# Altium project CM4.PrjPcb
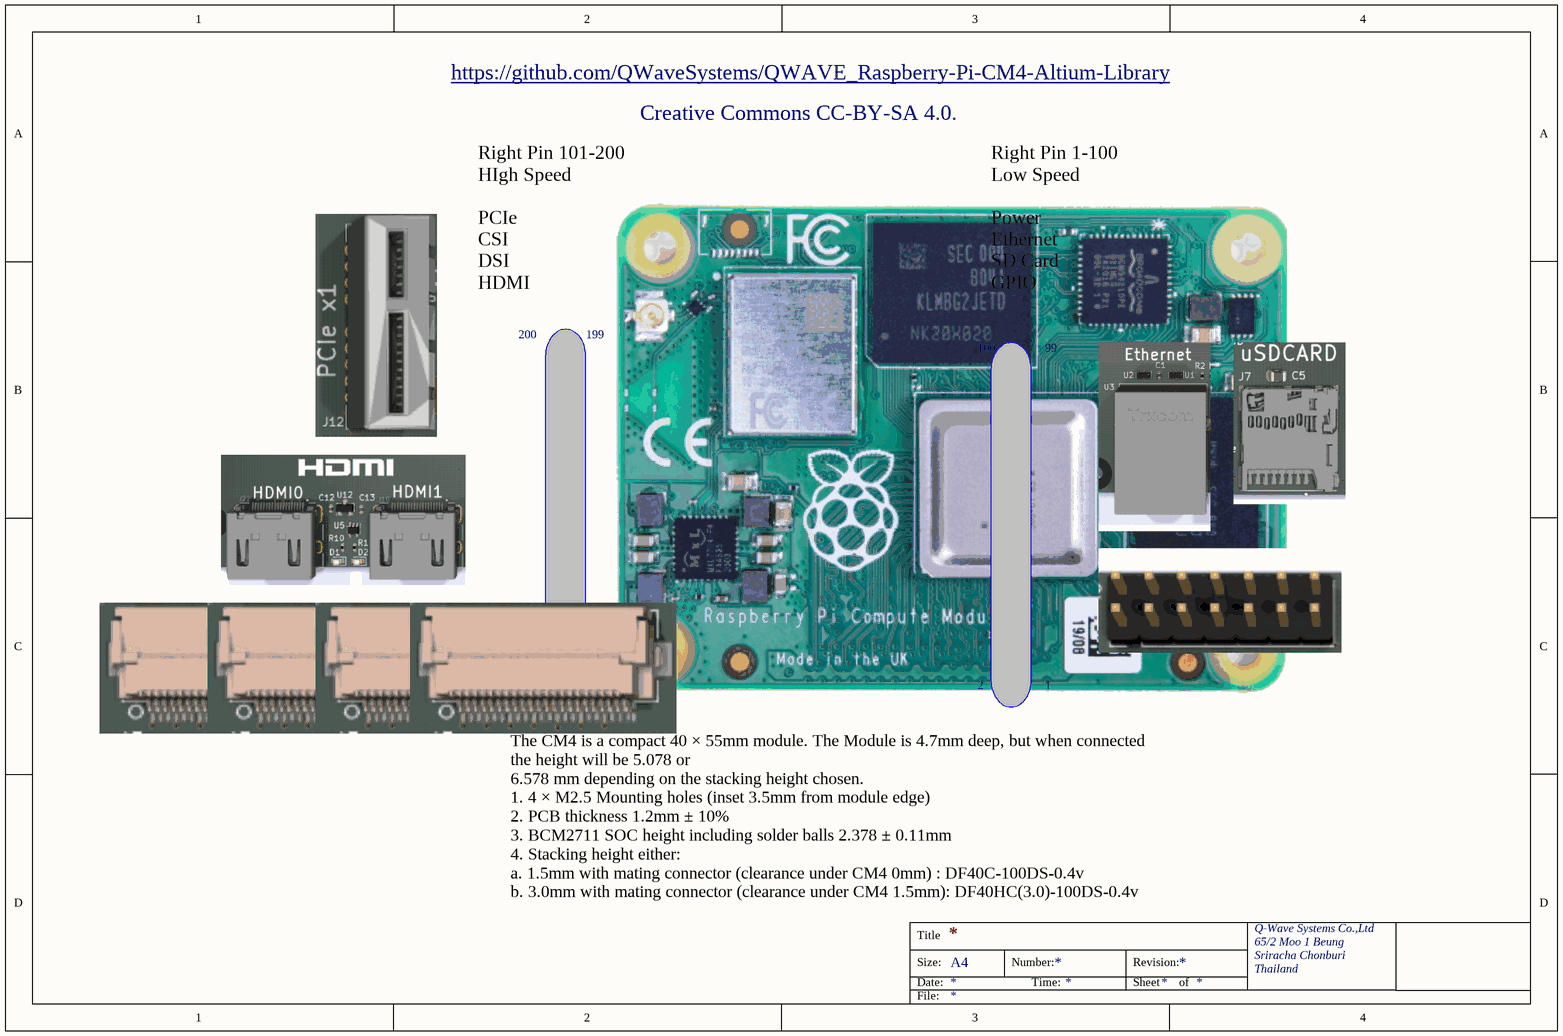
[diagram p0: Top_Level_Block Diagram.SchDoc]
22 sheets, 11 parts. Net scope: global (net labels, ports and power ports of the same name join across sheets).
Board file: CM4-Main.PcbDoc
Sheets:
  Top_Level_Block Diagram.SchDoc
  All Component_0.SchDoc
  All Component_1.SchDoc
  Connector.SchDoc
  Spacer_M2.5.SchDoc
  GPIO.SchDoc
  Power.SchDoc
  HDMI2.0.SchDoc
  CSI.SchDoc
  DSI.SchDoc
  Ethernet.SchDoc
  USB.SchDoc
  PCIe.SchDoc
  SD Card.SchDoc
  BT WiFi Power Reset Control.SchDoc
  TV DAC.SchDoc
  LEDs.SchDoc
  Differential Pair match spec.SchDoc
  CMIO4 PCB Stackup.SchDoc
  3D_Board_View.SchDoc
  QWAVE-Stackup_Design_6Layer_3GHz.SchDoc
  PCB_Footprint.SchDoc

## Sheet Top_Level_Block Diagram.SchDoc
size A4

### Notes on the sheet
- https://github.com/QWaveSystems/QWAVE_Raspberry-Pi-CM4-Altium-Library
- Creative Commons CC-BY-SA 4.0.
- Right Pin 101-200
  HIgh Speed
  PCIe
  CSI
  DSI
  HDMI
- Right Pin 1-100
  Low Speed
  Power
  Ethernet
  SD Card
  GPIO
- 200
- 199
- 100
- 99
- 102
- 101
- 2
- 1
- The CM4 is a compact 40 × 55mm module. The Module is 4.7mm deep, but when connected the height will be 5.078 or
  6.578 mm depending on the stacking height chosen.
  1. 4 × M2.5 Mounting holes (inset 3.5mm from module edge)
  2. PCB thickness 1.2mm ± 10%
  3. BCM2711 SOC height including solder balls 2.378 ± 0.11mm
  4. Stacking height either:
  a. 1.5mm with mating connector (clearance under CM4 0mm) : DF40C-100DS-0.4v
  b. 3.0mm with mating connector (clearance under CM4 1.5mm): DF40HC(3.0)-100DS-0.4v
- Title
- Size:
- Date:
- A4
- Number:
- Time:
- Revision:
- Sheet
- of
- Q-Wave Systems Co.,Ltd
- 65/2 Moo 1 Beung
- Sriracha Chonburi
- Thailand
- File:

## Sheet All Component_0.SchDoc
size A4
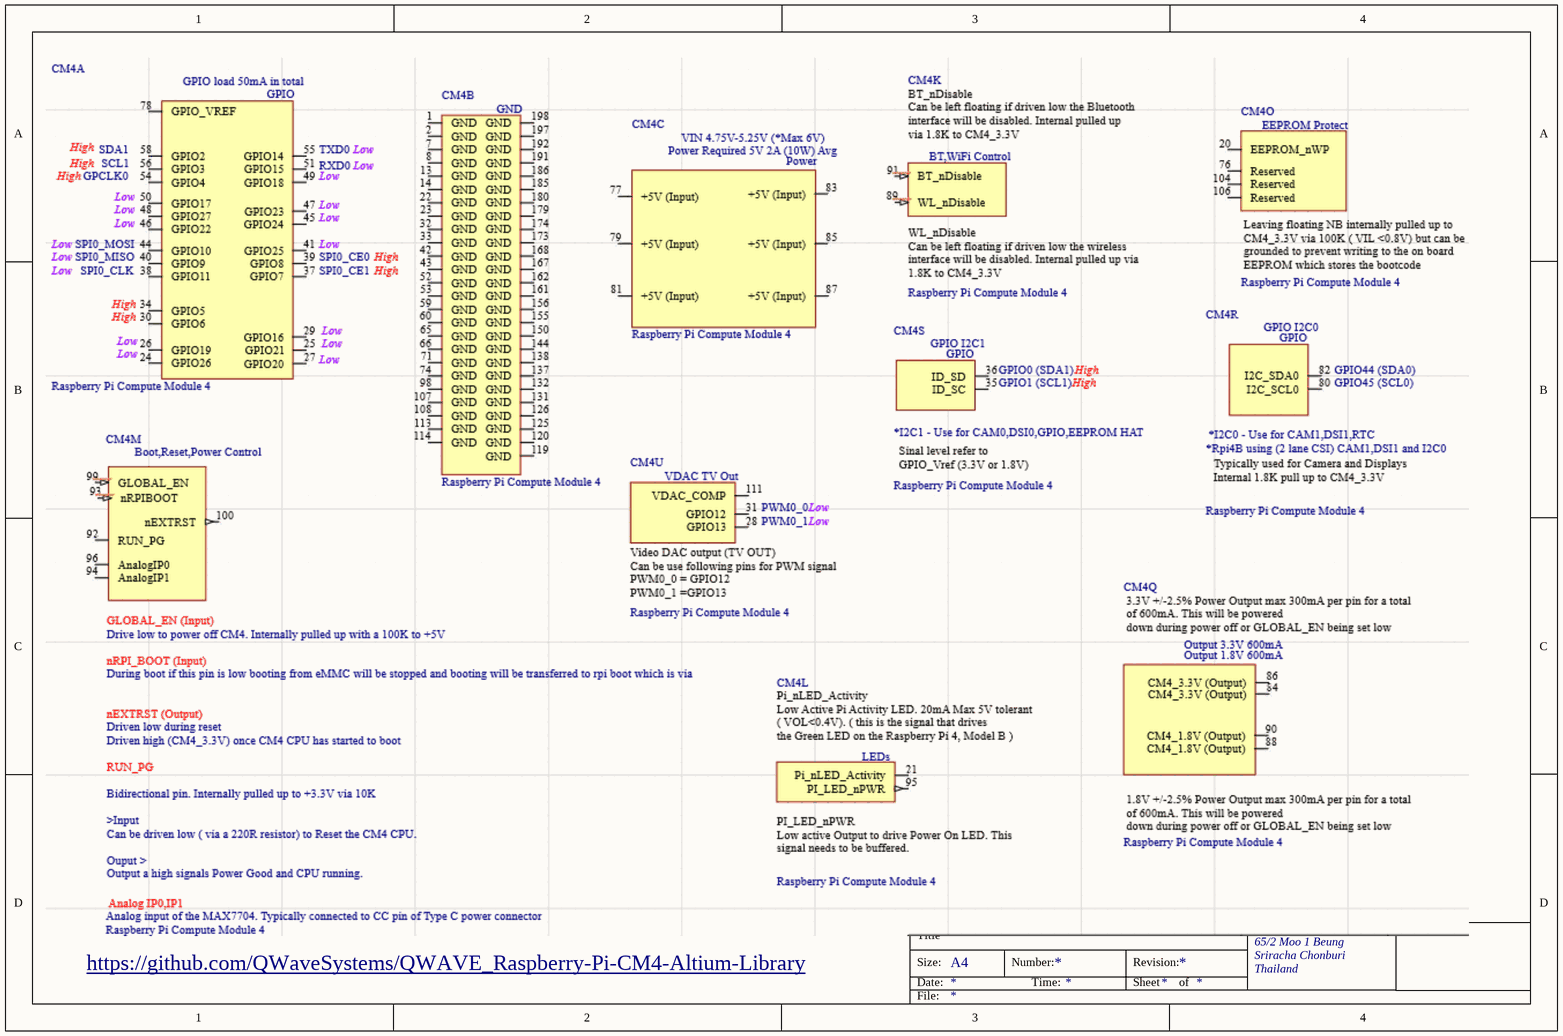
[diagram p1: All Component_0.SchDoc]

### Notes on the sheet
- https://github.com/QWaveSystems/QWAVE_Raspberry-Pi-CM4-Altium-Library
- Title
- Size:
- Date:
- A4
- Number:
- Time:
- Revision:
- Sheet
- of
- Q-Wave Systems Co.,Ltd
- 65/2 Moo 1 Beung
- Sriracha Chonburi
- Thailand
- File:

## Sheet All Component_1.SchDoc
size A4
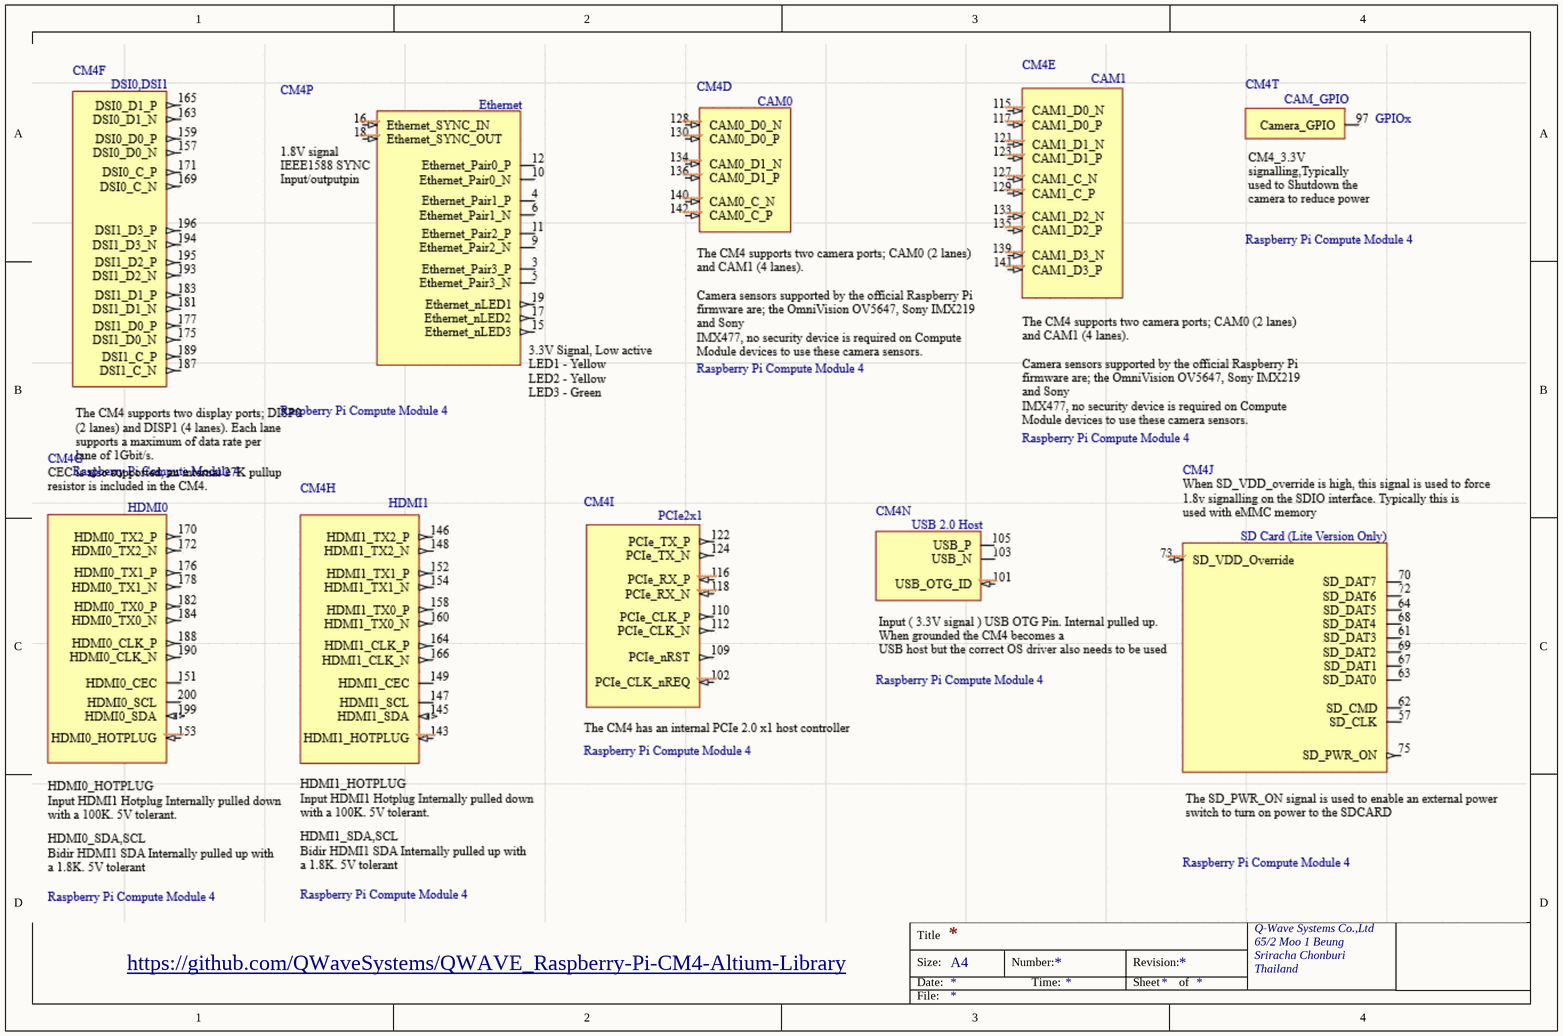
[diagram p2: All Component_1.SchDoc]

### Notes on the sheet
- https://github.com/QWaveSystems/QWAVE_Raspberry-Pi-CM4-Altium-Library
- Title
- Size:
- Date:
- A4
- Number:
- Time:
- Revision:
- Sheet
- of
- Q-Wave Systems Co.,Ltd
- 65/2 Moo 1 Beung
- Sriracha Chonburi
- Thailand
- File:

## Sheet Connector.SchDoc
size A4
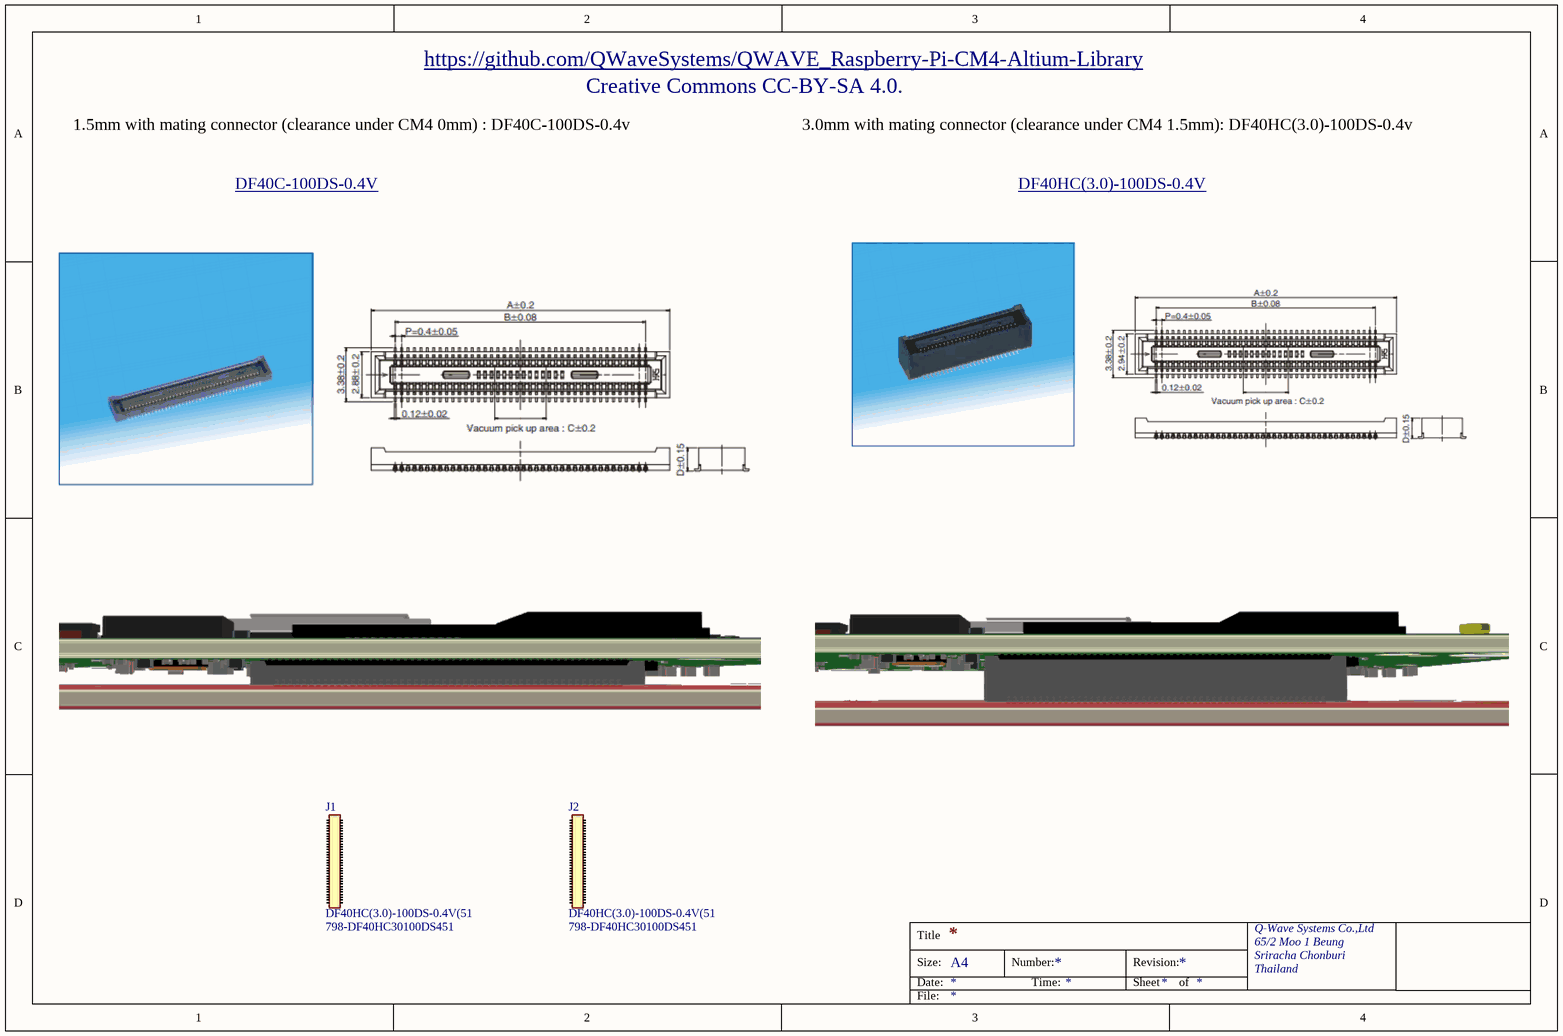
[diagram p3: Connector.SchDoc]

### Parts
J1  DF40HC(3.0)-100DS-0.4V(51  Supplier Part Number 1: 798-DF40HC30100DS451  [CM4-DF40]  (mechanical)
J2  DF40HC(3.0)-100DS-0.4V(51  Supplier Part Number 1: 798-DF40HC30100DS451  [CM4-DF40]  (mechanical)

### Notes on the sheet
- https://github.com/QWaveSystems/QWAVE_Raspberry-Pi-CM4-Altium-Library
- Creative Commons CC-BY-SA 4.0.
- 1.5mm with mating connector (clearance under CM4 0mm) : DF40C-100DS-0.4v
- 3.0mm with mating connector (clearance under CM4 1.5mm): DF40HC(3.0)-100DS-0.4v
- DF40C-100DS-0.4V <https://www.hirose.com/product/p/CL0684-4033-4-51>
- DF40HC(3.0)-100DS-0.4V <https://www.hirose.com/product/p/CL0684-4151-0-51>
- Title
- Size:
- Date:
- A4
- Number:
- Time:
- Revision:
- Sheet
- of
- Q-Wave Systems Co.,Ltd
- 65/2 Moo 1 Beung
- Sriracha Chonburi
- Thailand
- File:

### Library data of the parts
J1 J2 = DF40HC_3.0_-100DS-0.4V_51: Conn Board to Board RCP 100 POS 0.4mm Solder ST SMD T/R; Manufacturer_Name: Hirose; Connector Type: Receptacle; Number of Positions: 100; Pitch: 0.016inch; Datasheet Link: https://componentsearchengine.com/Datasheets/1/DF40HC(3.0)-100DS-0.4V(51.pdf; Height: 3.05mm; Manufacturer_Part_Number: DF40HC(3.0)-100DS-0.4V(51; Mouser Part Number: 798-DF40HC30100DS451; Mouser Price/Stock: https://www.mouser.co.uk/ProductDetail/Hirose-Connector/DF40HC30-100DS-04V51/?qs=%252BAZVS4b%2FkgIV%252B3vHYy2dCA%3D%3D; Arrow Part Number: DF40HC(3.0)-100DS-0.4V(51; Arrow Price/Stock: https://www.arrow.com/en/products/df40hc-3.0-100ds-0.4v-51/hirose-electric; Supplier 1: Mouser; Manufacturer: Hirose; Manufacturer Part Number: DF40HC(3.0)-100DS-0.4V(51; RoHS: Yes; Category: Headers and Wire Housings; Stock 1: 1901; Pricing 1: 1=2.50000, 10=2.15000, 50=2.15000, 100=2.00000, 1000=1.45000, 10000=1.29000 (USD); Mount: Surface Mount; Contact Plating: Gold; Package Quantity: 3000; Packaging: Tape and Reel; Number of Rows: 2; ComponentLink1URL: https://datasheet.ciiva.com/13559/ed-df40-20140305-13559540.pdf?src-supplier=Mouser; ComponentLink1Description: https://datasheet.ciiva.com/13559/ed-df40-20140305-13559540.pdf?src-supplier=Mouser; ComponentLink2URL: https://datasheet.ciiva.com/18562/ed-df40-20140305-18562462.pdf?src-supplier=Digi-Key; ComponentLink2Description: https://datasheet.ciiva.com/18562/ed-df40-20140305-18562462.pdf?src-supplier=Digi-Key

## Sheet Spacer_M2.5.SchDoc
size A4
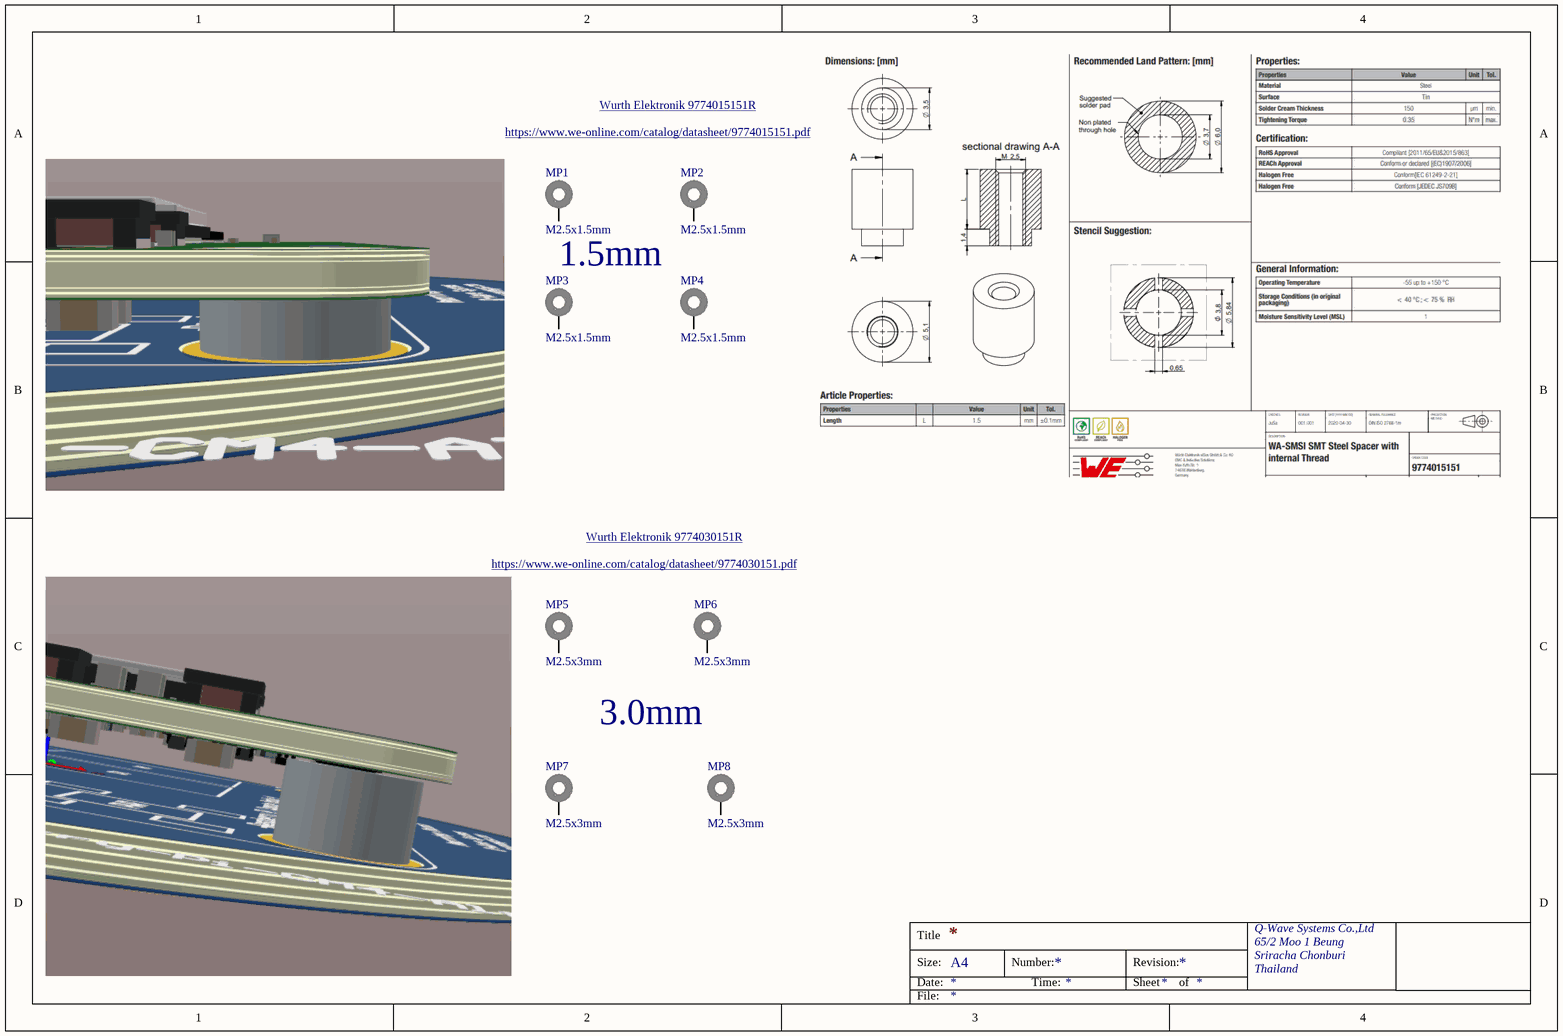
[diagram p4: Spacer_M2.5.SchDoc]

### Parts
MP1  M2.5x1.5mm  [9774015151]
MP2  M2.5x1.5mm  [9774015151]
MP3  M2.5x1.5mm  [9774015151]
MP4  M2.5x1.5mm  [9774015151]
MP5  M2.5x3mm  [9774030151]
MP6  M2.5x3mm  [9774030151]
MP7  M2.5x3mm  [9774030151]
MP8  M2.5x3mm  [9774030151]

### Nets

Not connected (* = marked no-connect by the designer): MP1 1; MP2 1; MP3 1; MP4 1; MP5 1; MP6 1; MP7 1; MP8 1

### Notes on the sheet
- Wurth Elektronik 9774015151R <https://th.mouser.com/ProductDetail/Wurth-Elektronik/9774015151R?qs=KRpiEsko4Hl%2FDg5uCSpysw%3D%3D>
- https://www.we-online.com/catalog/datasheet/9774015151.pdf
- 1.5mm
- https://www.we-online.com/catalog/datasheet/9774030151.pdf
- Wurth Elektronik 9774030151R <https://th.mouser.com/ProductDetail/Wurth-Elektronik/9774030151R?qs=%2Fha2pyFaduhpL3ruLypYIwk1EDfzek6QtU2BoXAdTMSAq8D2gXpyew%3D%3D>
- 3.0mm
- Title
- Size:
- Date:
- A4
- Number:
- Time:
- Revision:
- Sheet
- of
- Q-Wave Systems Co.,Ltd
- 65/2 Moo 1 Beung
- Sriracha Chonburi
- Thailand
- File:

### Library data of the parts
MP1-MP4 = 9774015151: WA-SMSI SMT Steel Spacer, M2.5 Thread Internal, OD 5.1mm, M2.5x1.5mm; Manufacturer: Wurth Elektronik; Inner Diameter: 3.5mm; Surface: Tin; ComponentLink1Description: Manufacturer; ComponentLink1URL: http://www.we-online.de; ComponentLink2Description: Datasheet; ComponentLink2URL: https://www.we-online.com/catalog/datasheet/9774015151.pdf; Mounting Technology: SMT; Packaging: Bulk; Manufacturer Part Number: 9774015151; Length: 1.5mm; Inner Thread Length: -; Operating Temperature: -55 to +150degC; Outer Diameter: 5.1mm; Published Date: April 2020; Material: Steel; Thread: M2.5
MP5-MP8 = 9774030151: WA-SMSI SMT Steel Spacer, M2.5 Thread Internal, OD 5.1mm, M2.5x3mm; Manufacturer: Wurth Elektronik; Inner Diameter: 3.5mm; Surface: Tin; ComponentLink1Description: Manufacturer; ComponentLink1URL: http://www.we-online.de; ComponentLink2Description: Datasheet; ComponentLink2URL: https://www.we-online.com/catalog/datasheet/9774030151.pdf; Mounting Technology: SMT; Packaging: Bulk; Manufacturer Part Number: 9774030151; Length: 3mm; Inner Thread Length: -; Operating Temperature: -55 to +150degC; Outer Diameter: 5.1mm; Published Date: April 2020; Material: Steel; Thread: M2.5

## Sheet GPIO.SchDoc
size A4
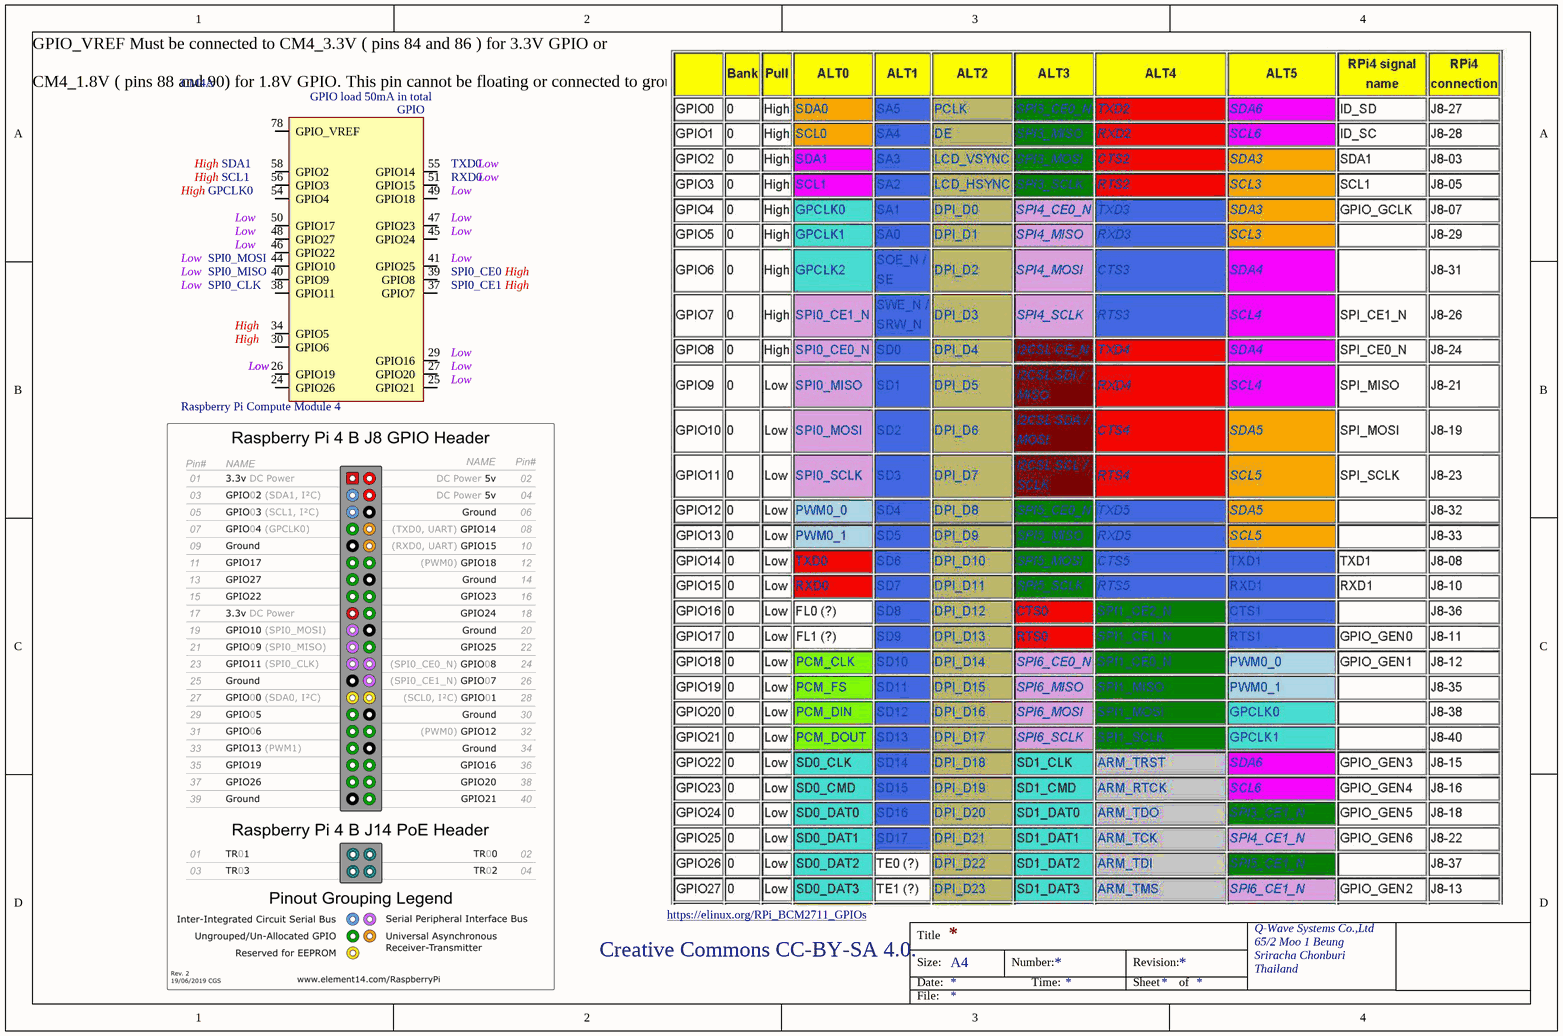
[diagram p5: GPIO.SchDoc]

### Parts
CM4  Raspberry Pi Compute Module 4  [CM4-F40C-100DS-0.4v_1.5mm_0mm]  (part A of 21)  (no BOM)

### Nets

Not connected (* = marked no-connect by the designer): CM4 24(GPIO26) 25(GPIO21) 26(GPIO19) 27(GPIO20) 29(GPIO16) 30(GPIO6) 34(GPIO5) 37(GPIO7) 38(GPIO11) 39(GPIO8) 40(GPIO9) 41(GPIO25) 44(GPIO10) 45(GPIO24) 46(GPIO22) 47(GPIO23) 48(GPIO27) 49(GPIO18) 50(GPIO17) 51(GPIO15) 54(GPIO4) 55(GPIO14) 56(GPIO3) 58(GPIO2) 78(GPIO_VREF)

### Notes on the sheet
- (near CM4) GPIO_VREF Must be connected to CM4_3.3V ( pins 84 and 86 ) for 3.3V GPIO or
  CM4_1.8V ( pins 88 and 90) for 1.8V GPIO. This pin cannot be floating or connected to ground
- https://elinux.org/RPi_BCM2711_GPIOs
- Creative Commons CC-BY-SA 4.0.
- Title
- Size:
- Date:
- A4
- Number:
- Time:
- Revision:
- Sheet
- of
- Q-Wave Systems Co.,Ltd
- 65/2 Moo 1 Beung
- Sriracha Chonburi
- Thailand
- File:
- (in symbol CM4, part A) GPIO load 50mA in total; GPIO; High; SDA1; TXD0; Low; SCL1; RXD0; GPCLK0; SPI0_MOSI; SPI0_MISO; SPI0_CE0; SPI0_CLK; SPI0_CE1; by Amornthep Phunsin

### Library data of the parts
CM4 = CM4: Raspberry Pi Compute Module 4 by Amornthep Phunsin

## Sheet Power.SchDoc
size A4
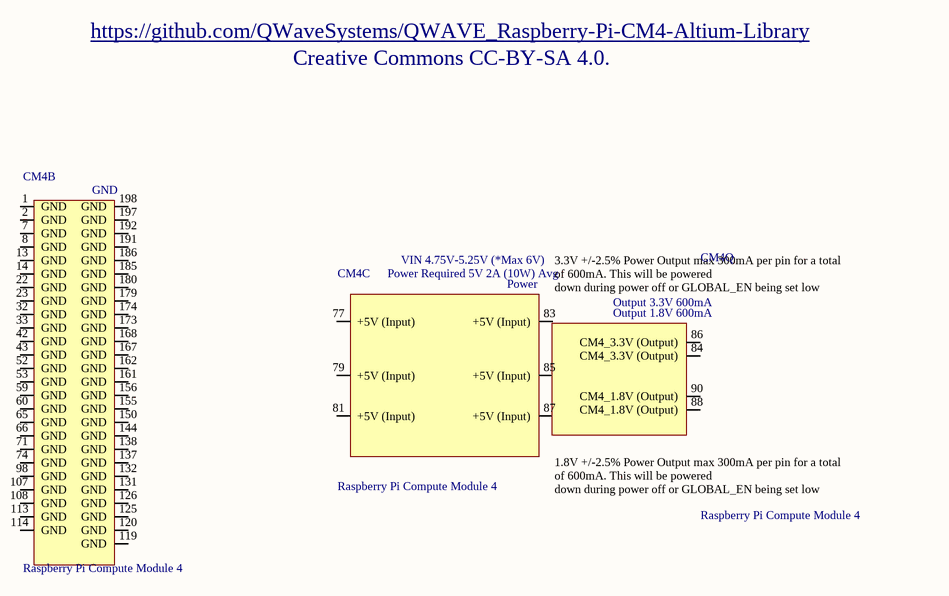
[diagram p6: Power.SchDoc]

### Parts
CM4  Raspberry Pi Compute Module 4  [CM4-F40C-100DS-0.4v_1.5mm_0mm]  (parts B,C,Q of 21)  (no BOM)

### Nets

Not connected (* = marked no-connect by the designer): CM4 1(GND) 2(GND) 7(GND) 8(GND) 13(GND) 14(GND) 22(GND) 23(GND) 32(GND) 33(GND) 42(GND) 43(GND) 52(GND) 53(GND) 59(GND) 60(GND) 65(GND) 66(GND) 71(GND) 74(GND) 77(+5V_(Input)) 79(+5V_(Input)) 81(+5V_(Input)) 83(+5V_(Input)) 84(CM4_3.3V_(Output)) 85(+5V_(Input)) 86(CM4_3.3V_(Output)) 87(+5V_(Input)) 88(CM4_1.8V_(Output)) 90(CM4_1.8V_(Output)) 98(GND) 107(GND) 108(GND) 113(GND) 114(GND) 119(GND) 120(GND) 125(GND) 126(GND) 131(GND) 132(GND) 137(GND) 138(GND) 144(GND) 150(GND) 155(GND) 156(GND) 161(GND) 162(GND) 167(GND) 168(GND) 173(GND) 174(GND) 179(GND) 180(GND) 185(GND) 186(GND) 191(GND) 192(GND) 197(GND) 198(GND)

### Notes on the sheet
- https://github.com/QWaveSystems/QWAVE_Raspberry-Pi-CM4-Altium-Library
- Creative Commons CC-BY-SA 4.0.
- Title
- Size:
- Date:
- A4
- Number:
- Time:
- Revision:
- Sheet
- of
- Q-Wave Systems Co.,Ltd
- 65/2 Moo 1 Beung
- Sriracha Chonburi
- Thailand
- File:
- (in symbol CM4, part C) VIN 4.75V-5.25V (*Max 6V); Power Required 5V 2A (10W) Avg; Power; by Amornthep Phunsin
- (in symbol CM4, part Q) 3.3V +/-2.5% Power Output max 300mA per pin for a total of 600mA. This will be powered / down during power off or GLOBAL_EN being set low; Output 3.3V 600mA; Output 1.8V 600mA; 1.8V +/-2.5% Power Output max 300mA per pin for a total of 600mA. This will be powered / down during power off or GLOBAL_EN being set low

### Library data of the parts
CM4 = CM4: as CM4 on sheet GPIO

## Sheet HDMI2.0.SchDoc
size A4
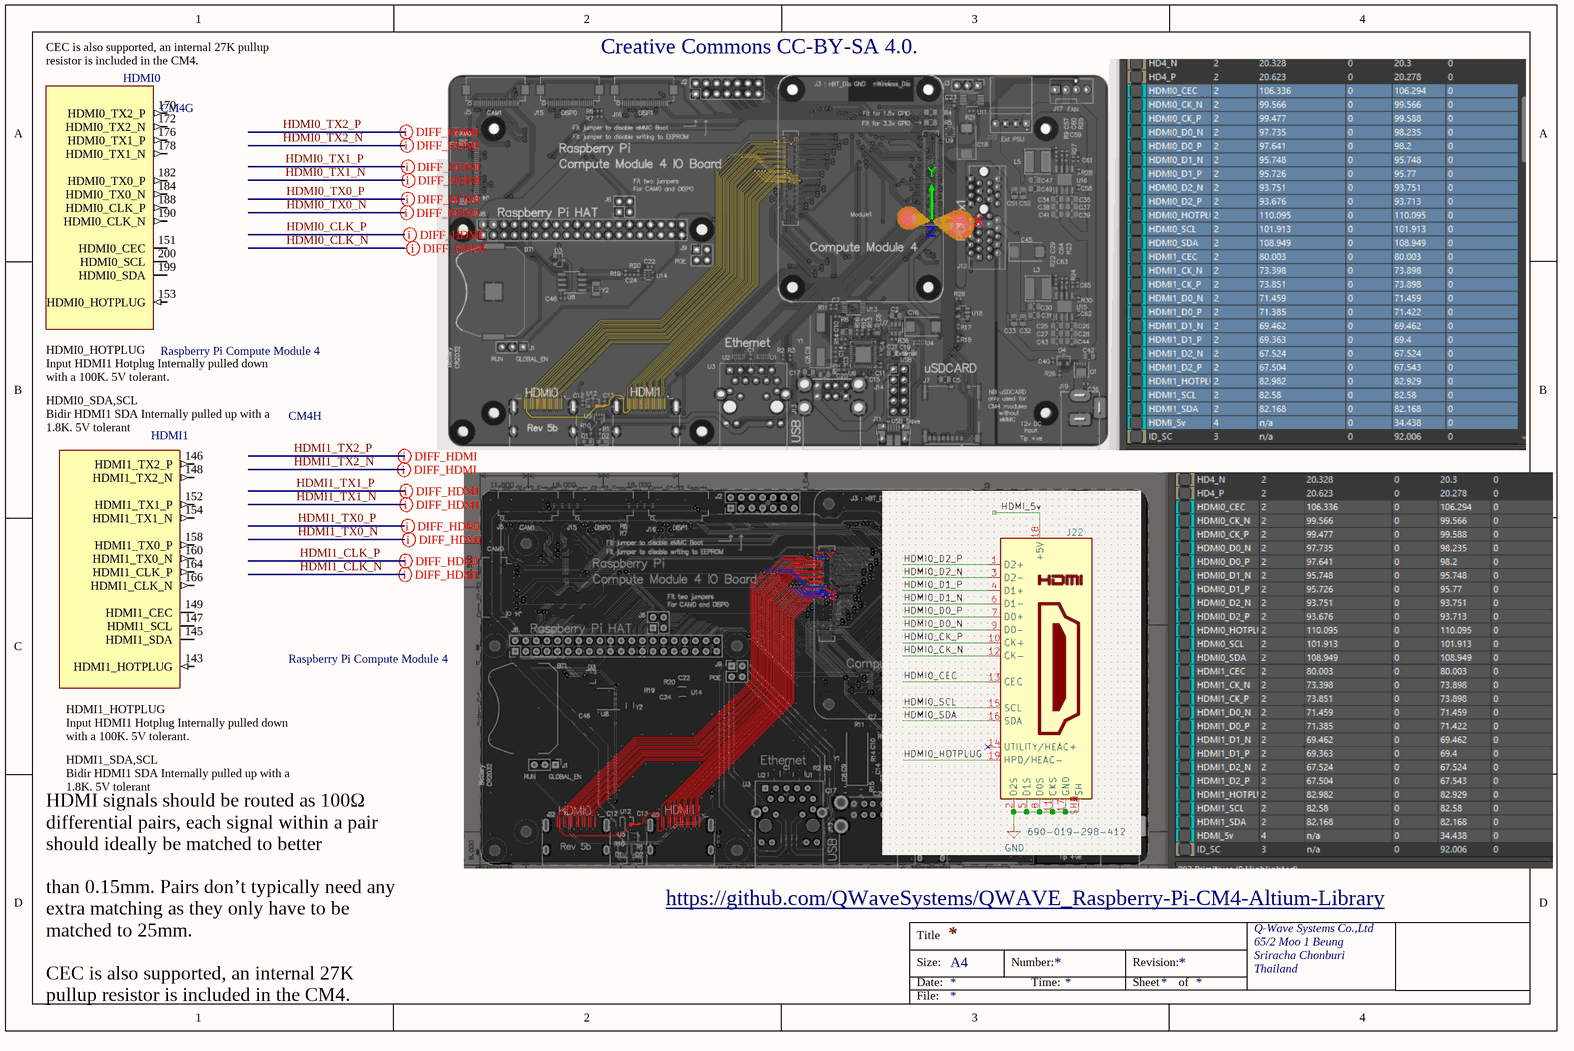
[diagram p7: HDMI2.0.SchDoc]

### Parts
CM4  Raspberry Pi Compute Module 4  [CM4-F40C-100DS-0.4v_1.5mm_0mm]  (parts G,H of 21)  (no BOM)

### Nets

Not connected (* = marked no-connect by the designer): CM4 143(HDMI1_HOTPLUG) 145(HDMI1_SDA) 146(HDMI1_TX2_P) 147(HDMI1_SCL) 148(HDMI1_TX2_N) 149(HDMI1_CEC) 151(HDMI0_CEC) 152(HDMI1_TX1_P) 153(HDMI0_HOTPLUG) 154(HDMI1_TX1_N) 158(HDMI1_TX0_P) 160(HDMI1_TX0_N) 164(HDMI1_CLK_P) 166(HDMI1_CLK_N) 170(HDMI0_TX2_P) 172(HDMI0_TX2_N) 176(HDMI0_TX1_P) 178(HDMI0_TX1_N) 182(HDMI0_TX0_P) 184(HDMI0_TX0_N) 188(HDMI0_CLK_P) 190(HDMI0_CLK_N) 199(HDMI0_SDA) 200(HDMI0_SCL)

### Layout directives
differential pair; differential pair class DIFF_100Ohm_HDMI; differential pair class DIFF_HDMI; net class HDMI_18Gbps: HDMI0_CLK_N, HDMI0_CLK_P, HDMI0_TX0_N, HDMI0_TX0_P, HDMI0_TX1_N, HDMI0_TX1_P, HDMI0_TX2_N, HDMI0_TX2_P, HDMI1_CLK_N, HDMI1_CLK_P, HDMI1_TX0_N, HDMI1_TX0_P, HDMI1_TX1_N, HDMI1_TX1_P, HDMI1_TX2_N, HDMI1_TX2_P

### Notes on the sheet
- Creative Commons CC-BY-SA 4.0.
- https://github.com/QWaveSystems/QWAVE_Raspberry-Pi-CM4-Altium-Library
- HDMI signals should be routed as 100Ω differential pairs, each signal within a pair should ideally be matched to better
  than 0.15mm. Pairs don’t typically need any extra matching as they only have to be matched to 25mm.
  CEC is also supported, an internal 27K pullup resistor is included in the CM4.
- Title
- Size:
- Date:
- A4
- Number:
- Time:
- Revision:
- Sheet
- of
- Q-Wave Systems Co.,Ltd
- 65/2 Moo 1 Beung
- Sriracha Chonburi
- Thailand
- File:
- (in symbol CM4, part G) HDMI0; CEC is also supported, an internal 27K pullup resistor is included in the CM4.; HDMI0_HOTPLUG / Input HDMI1 Hotplug Internally pulled down with a 100K. 5V tolerant.; HDMI0_SDA,SCL / Bidir HDMI1 SDA Internally pulled up with a 1.8K. 5V tolerant
- (in symbol CM4, part H) HDMI1; HDMI1_HOTPLUG / Input HDMI1 Hotplug Internally pulled down with a 100K. 5V tolerant.; HDMI1_SDA,SCL / Bidir HDMI1 SDA Internally pulled up with a 1.8K. 5V tolerant

### Library data of the parts
CM4 = CM4: as CM4 on sheet GPIO

## Sheet CSI.SchDoc
size A4
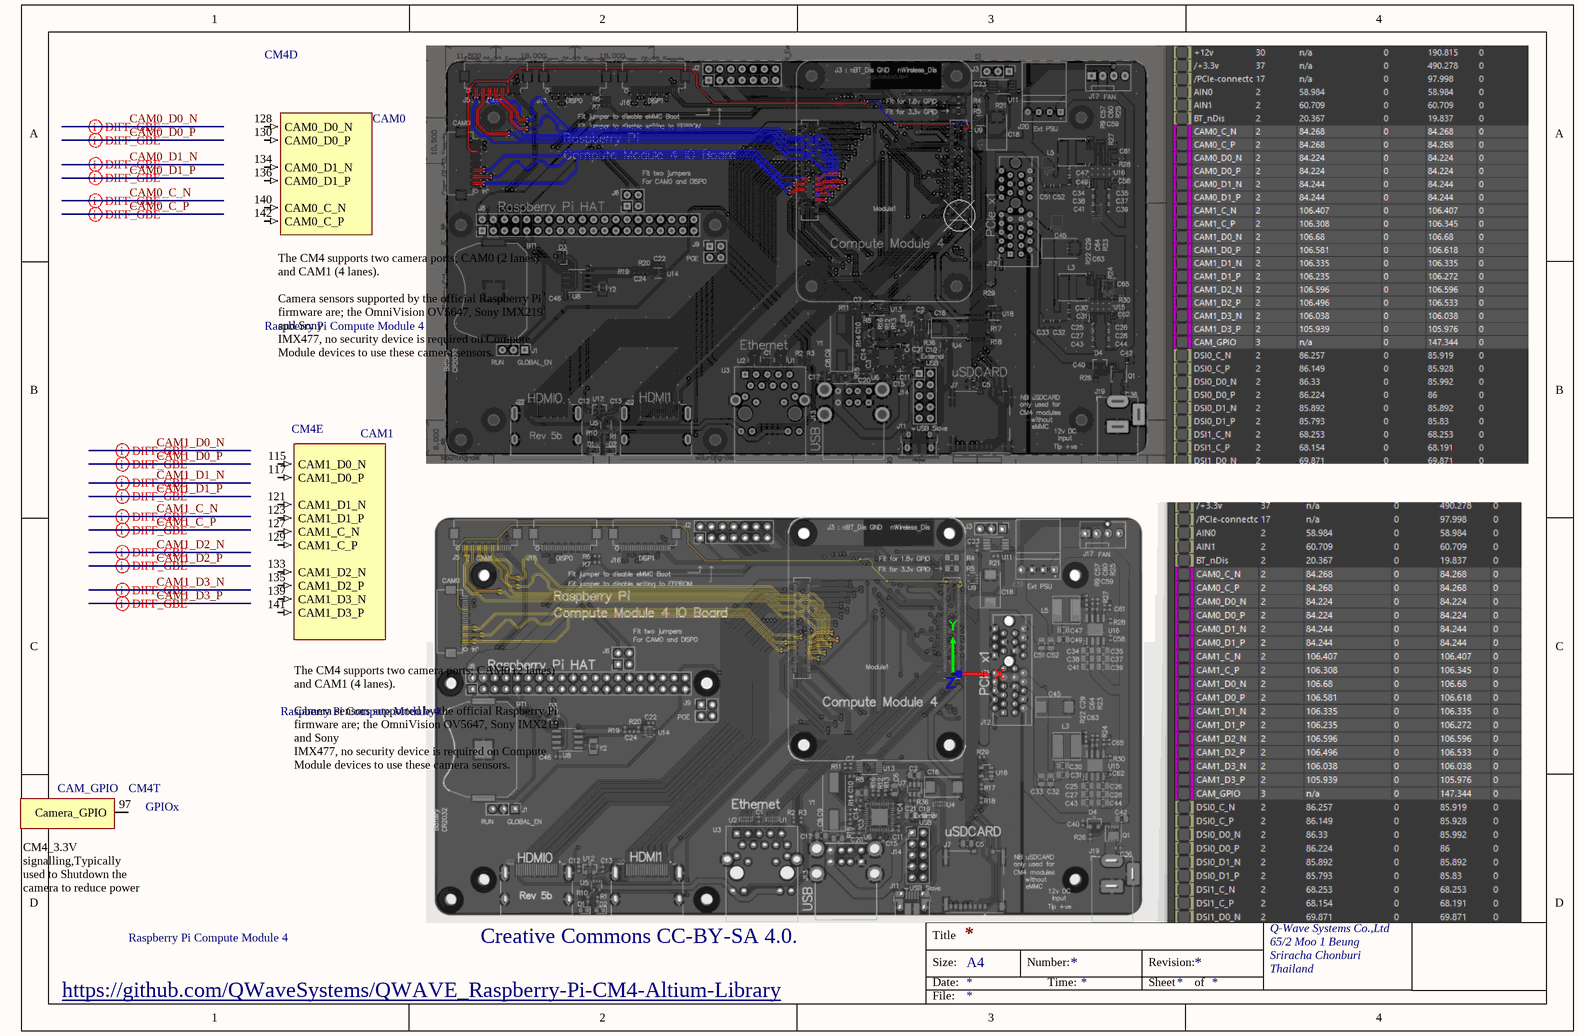
[diagram p8: CSI.SchDoc]

### Parts
CM4  Raspberry Pi Compute Module 4  [CM4-F40C-100DS-0.4v_1.5mm_0mm]  (parts D,E,T of 21)  (no BOM)

### Nets

Not connected (* = marked no-connect by the designer): CM4 97(Camera_GPIO) 115(CAM1_D0_N) 117(CAM1_D0_P) 121(CAM1_D1_N) 123(CAM1_D1_P) 127(CAM1_C_N) 128(CAM0_D0_N) 129(CAM1_C_P) 130(CAM0_D0_P) 133(CAM1_D2_N) 134(CAM0_D1_N) 135(CAM1_D2_P) 136(CAM0_D1_P) 139(CAM1_D3_N) 140(CAM0_C_N) 141(CAM1_D3_P) 142(CAM0_C_P)

### Layout directives
differential pair; differential pair class DIFF_100Ohm_MIPI; differential pair class DIFF_MIPI; net class MIPI_1Gbps: CAM0_C_N, CAM0_C_P, CAM0_D0_N, CAM0_D0_P, CAM0_D1_N, CAM0_D1_P, CAM1_C_N, CAM1_C_P, CAM1_D0_N, CAM1_D0_P, CAM1_D1_N, CAM1_D1_P, CAM1_D2_N, CAM1_D2_P, CAM1_D3_N, CAM1_D3_P

### Notes on the sheet
- Creative Commons CC-BY-SA 4.0.
- https://github.com/QWaveSystems/QWAVE_Raspberry-Pi-CM4-Altium-Library
- Title
- Size:
- Date:
- A4
- Number:
- Time:
- Revision:
- Sheet
- of
- Q-Wave Systems Co.,Ltd
- 65/2 Moo 1 Beung
- Sriracha Chonburi
- Thailand
- File:
- (in symbol CM4, part D) CAM0; The CM4 supports two camera ports; CAM0 (2 lanes) and CAM1 (4 lanes). / Camera sensors supported by the official Raspberry Pi firmware are; the OmniVision OV5647, Sony IMX219 and Sony / IMX477, no security device is required on Compute Module devices to use these camera sensors.
- (in symbol CM4, part E) CAM1; The CM4 supports two camera ports; CAM0 (2 lanes) and CAM1 (4 lanes). / Camera sensors supported by the official Raspberry Pi firmware are; the OmniVision OV5647, Sony IMX219 and Sony / IMX477, no security device is required on Compute Module devices to use these camera sensors.
- (in symbol CM4, part T) CAM_GPIO; GPIOx; CM4_3.3V signalling,Typically used to Shutdown the camera to reduce power

### Library data of the parts
CM4 = CM4: as CM4 on sheet GPIO

## Sheet DSI.SchDoc
size A4
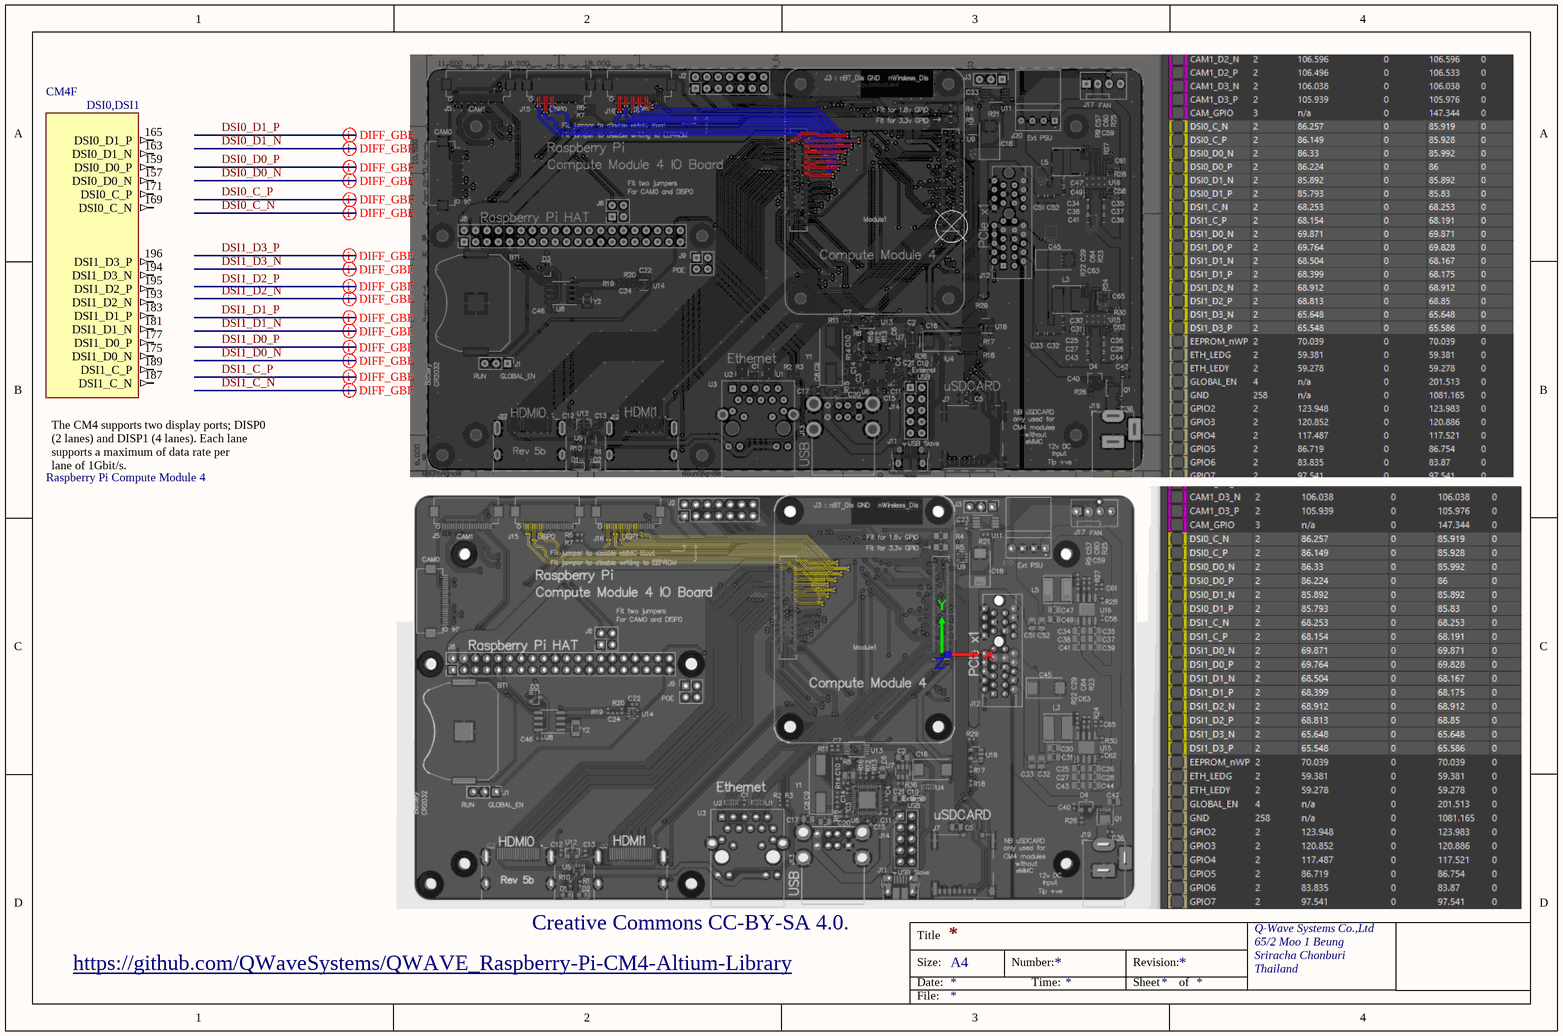
[diagram p9: DSI.SchDoc]

### Parts
CM4  Raspberry Pi Compute Module 4  [CM4-F40C-100DS-0.4v_1.5mm_0mm]  (part F of 21)  (no BOM)

### Nets

Not connected (* = marked no-connect by the designer): CM4 157(DSI0_D0_N) 159(DSI0_D0_P) 163(DSI0_D1_N) 165(DSI0_D1_P) 169(DSI0_C_N) 171(DSI0_C_P) 175(DSI1_D0_N) 177(DSI1_D0_P) 181(DSI1_D1_N) 183(DSI1_D1_P) 187(DSI1_C_N) 189(DSI1_C_P) 193(DSI1_D2_N) 194(DSI1_D3_N) 195(DSI1_D2_P) 196(DSI1_D3_P)

### Layout directives
differential pair; differential pair class DIFF_100Ohm_MIPI; differential pair class DIFF_MIPI; net class MIPI_1Gbps: DSI0_C_N, DSI0_C_P, DSI0_D0_N, DSI0_D0_P, DSI0_D1_N, DSI0_D1_P, DSI1_C_N, DSI1_C_P, DSI1_D0_N, DSI1_D0_P, DSI1_D1_N, DSI1_D1_P, DSI1_D2_N, DSI1_D2_P, DSI1_D3_N, DSI1_D3_P

### Notes on the sheet
- https://github.com/QWaveSystems/QWAVE_Raspberry-Pi-CM4-Altium-Library
- Creative Commons CC-BY-SA 4.0.
- Title
- Size:
- Date:
- A4
- Number:
- Time:
- Revision:
- Sheet
- of
- Q-Wave Systems Co.,Ltd
- 65/2 Moo 1 Beung
- Sriracha Chonburi
- Thailand
- File:
- (in symbol CM4, part F) DSI0,DSI1; The CM4 supports two display ports; DISP0 (2 lanes) and DISP1 (4 lanes). Each lane supports a maximum of data rate per / lane of 1Gbit/s.

### Library data of the parts
CM4 = CM4: as CM4 on sheet GPIO

## Sheet Ethernet.SchDoc
size A4
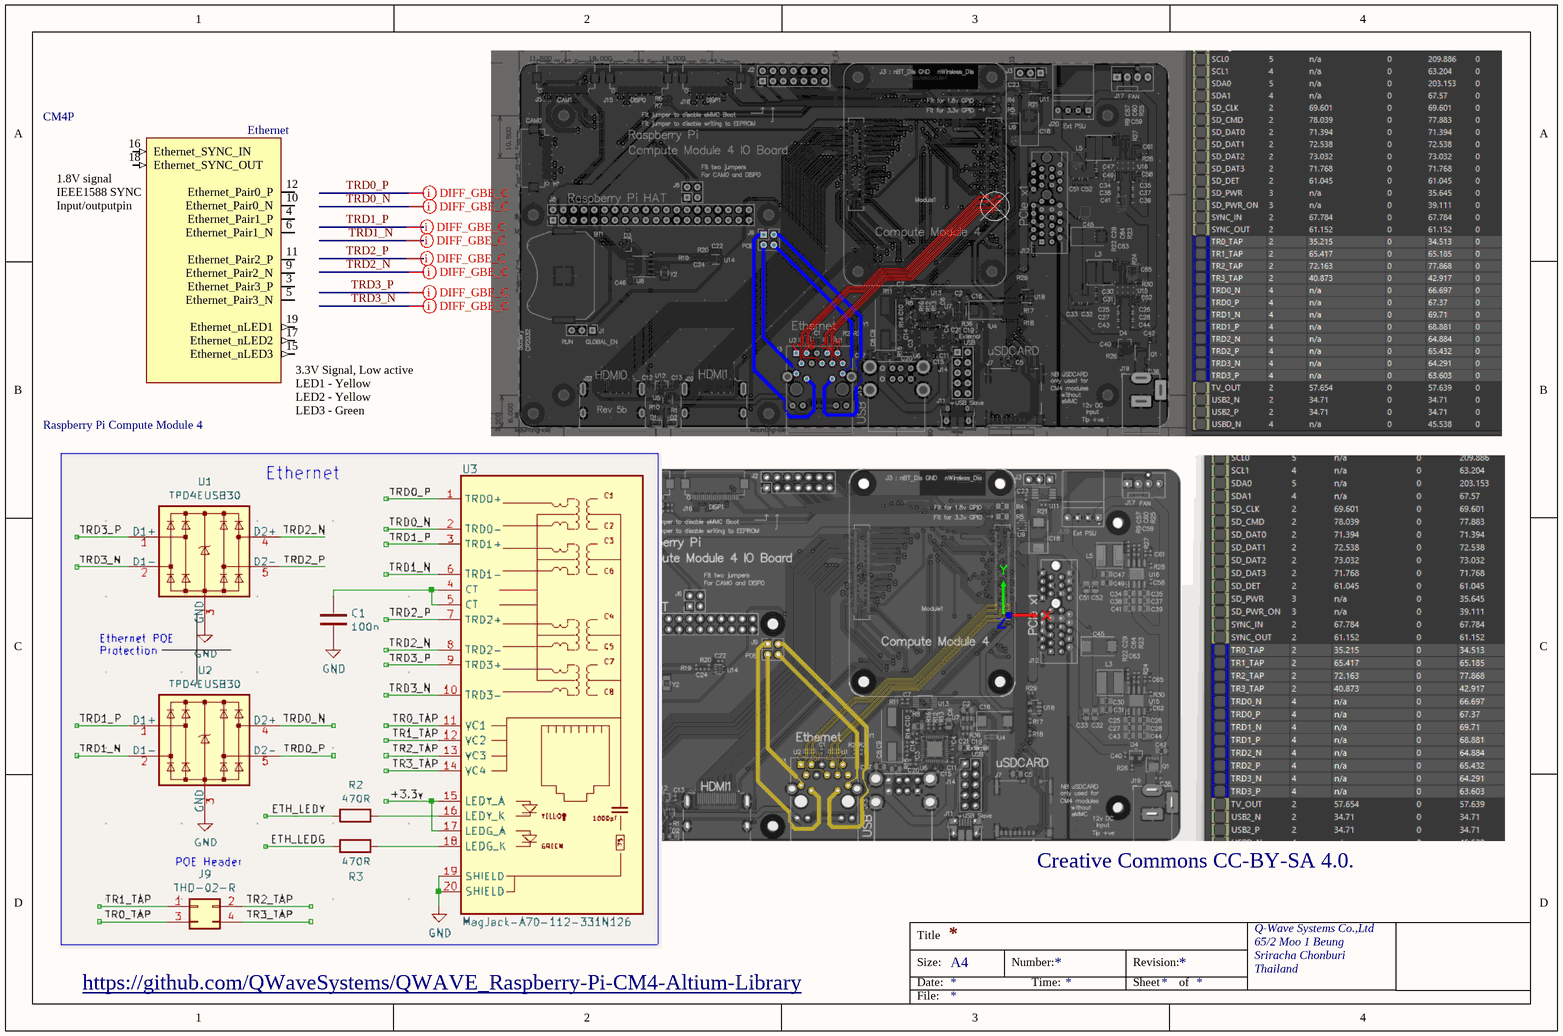
[diagram p10: Ethernet.SchDoc]

### Parts
CM4  Raspberry Pi Compute Module 4  [CM4-F40C-100DS-0.4v_1.5mm_0mm]  (part P of 21)  (no BOM)

### Nets

Not connected (* = marked no-connect by the designer): CM4 3(Ethernet_Pair3_P) 4(Ethernet_Pair1_P) 5(Ethernet_Pair3_N) 6(Ethernet_Pair1_N) 9(Ethernet_Pair2_N) 10(Ethernet_Pair0_N) 11(Ethernet_Pair2_P) 12(Ethernet_Pair0_P) 15(Ethernet_nLED3) 16(Ethernet_SYNC_IN) 17(Ethernet_nLED2) 18(Ethernet_SYNC_OUT) 19(Ethernet_nLED1)

### Layout directives
differential pair; differential pair class DIFF_100Ohm_GBE; differential pair class DIFF_LAN_GB; net class GBE_1Gbps: TRD0_N, TRD0_P, TRD1_N, TRD1_P, TRD2_N, TRD2_P, TRD3_N, TRD3_P

### Notes on the sheet
- Creative Commons CC-BY-SA 4.0.
- https://github.com/QWaveSystems/QWAVE_Raspberry-Pi-CM4-Altium-Library
- Title
- Size:
- Date:
- A4
- Number:
- Time:
- Revision:
- Sheet
- of
- Q-Wave Systems Co.,Ltd
- 65/2 Moo 1 Beung
- Sriracha Chonburi
- Thailand
- File:
- (in symbol CM4, part P) Ethernet; 1.8V signal / IEEE1588 SYNC Input/outputpin; by Amornthep Phunsin; 3.3V Signal, Low active / LED1 - Yellow / LED2 - Yellow / LED3 - Green

### Library data of the parts
CM4 = CM4: as CM4 on sheet GPIO

## Sheet USB.SchDoc
size A4
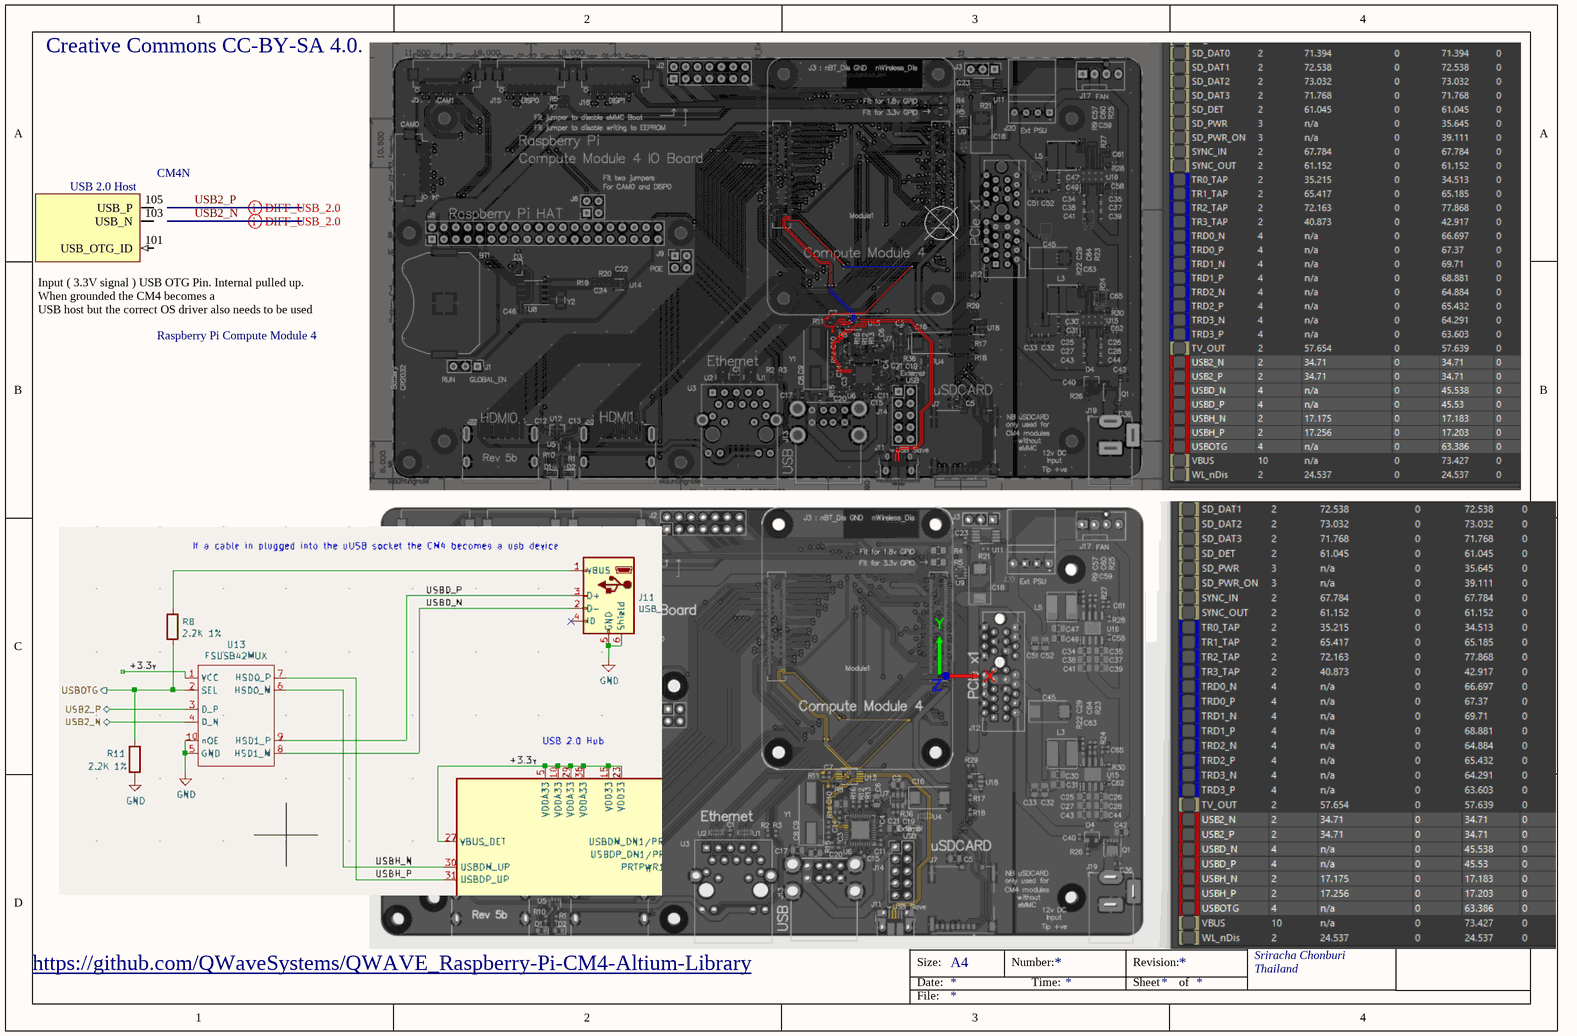
[diagram p11: USB.SchDoc]

### Parts
CM4  Raspberry Pi Compute Module 4  [CM4-F40C-100DS-0.4v_1.5mm_0mm]  (part N of 21)  (no BOM)

### Nets

Not connected (* = marked no-connect by the designer): CM4 101(USB_OTG_ID) 103(USB_N) 105(USB_P)

### Layout directives
differential pair; differential pair class DIFF_90Ohm_USB2.0; differential pair class DIFF_USB2.0; net class USB2.0_480Mbps: USB2_N, USB2_P

### Notes on the sheet
- Creative Commons CC-BY-SA 4.0.
- https://github.com/QWaveSystems/QWAVE_Raspberry-Pi-CM4-Altium-Library
- Title
- Size:
- Date:
- A4
- Number:
- Time:
- Revision:
- Sheet
- of
- Q-Wave Systems Co.,Ltd
- 65/2 Moo 1 Beung
- Sriracha Chonburi
- Thailand
- File:
- (in symbol CM4, part N) USB 2.0 Host; Input ( 3.3V signal ) USB OTG Pin. Internal pulled up. When grounded the CM4 becomes a / USB host but the correct OS driver also needs to be used

### Library data of the parts
CM4 = CM4: as CM4 on sheet GPIO

## Sheet PCIe.SchDoc
size A4
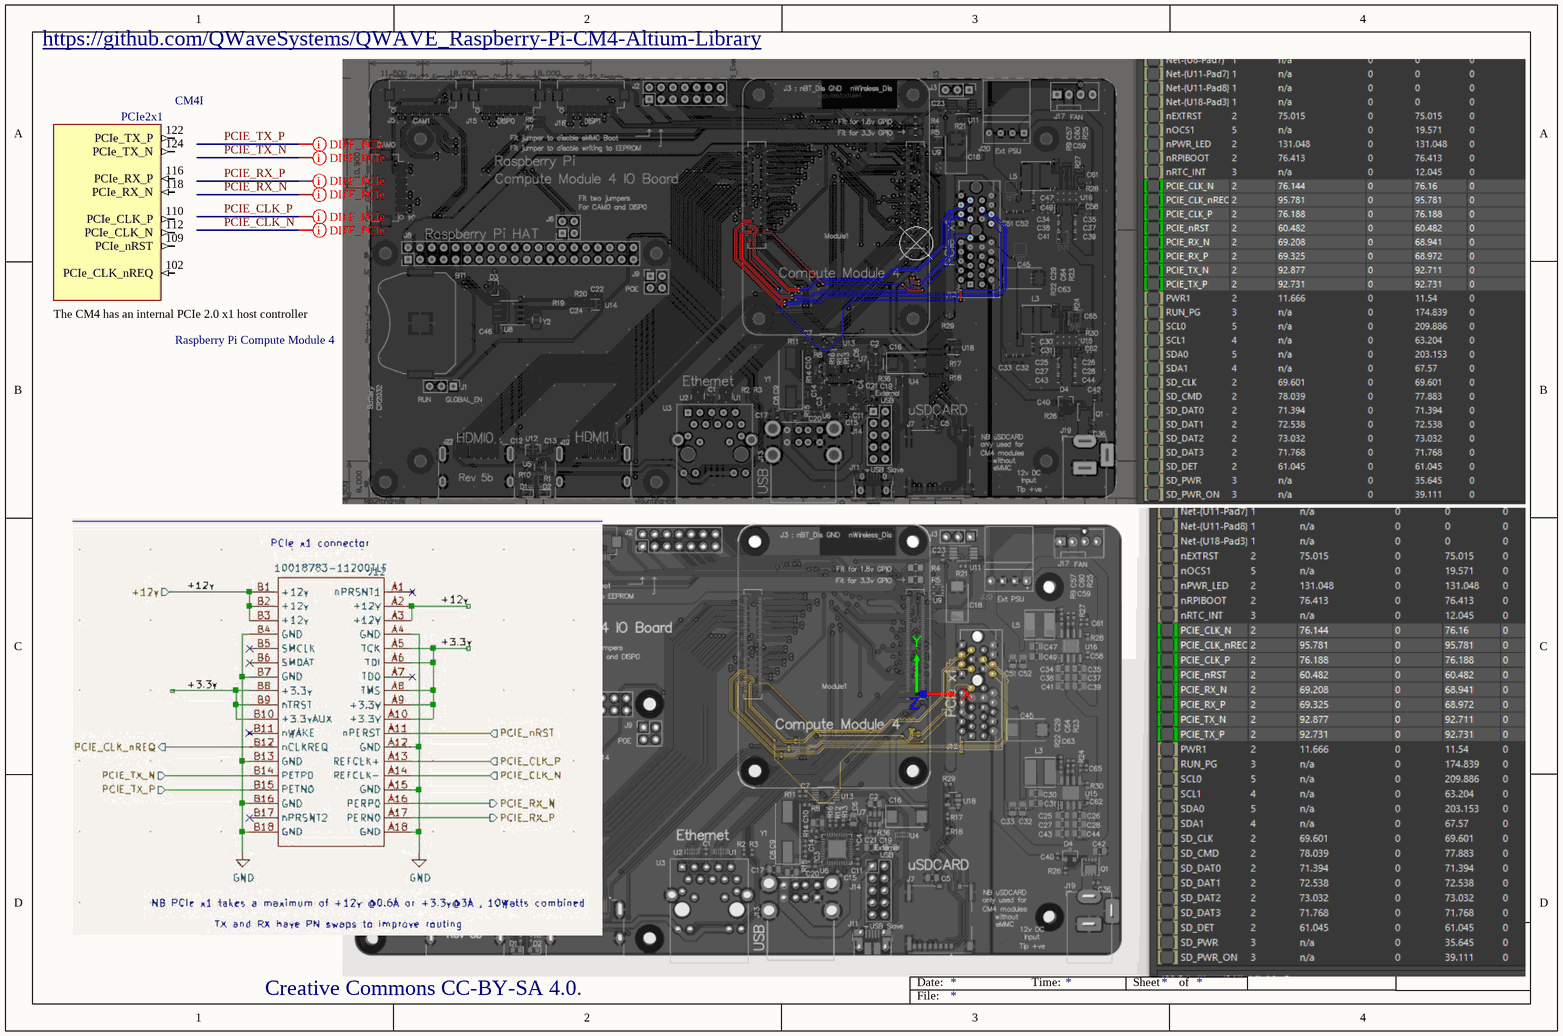
[diagram p12: PCIe.SchDoc]

### Parts
CM4  Raspberry Pi Compute Module 4  [CM4-F40C-100DS-0.4v_1.5mm_0mm]  (part I of 21)  (no BOM)

### Nets

Not connected (* = marked no-connect by the designer): CM4 102(PCIe_CLK_nREQ) 109(PCIe_nRST) 110(PCIe_CLK_P) 112(PCIe_CLK_N) 116(PCIe_RX_P) 118(PCIe_RX_N) 122(PCIe_TX_P) 124(PCIe_TX_N)

### Layout directives
differential pair; differential pair class DIFF_90Ohm_PCIe; differential pair class DIFF_PCIe; net class PCIe_5Gbps: PCIE_CLK_N, PCIE_CLK_P, PCIE_RX_N, PCIE_RX_P, PCIE_TX_N, PCIE_TX_P

### Notes on the sheet
- https://github.com/QWaveSystems/QWAVE_Raspberry-Pi-CM4-Altium-Library
- Creative Commons CC-BY-SA 4.0.
- Title
- Size:
- Date:
- A4
- Number:
- Time:
- Revision:
- Sheet
- of
- Q-Wave Systems Co.,Ltd
- 65/2 Moo 1 Beung
- Sriracha Chonburi
- Thailand
- File:
- (in symbol CM4, part I) PCIe2x1; The CM4 has an internal PCIe 2.0 x1 host controller

### Library data of the parts
CM4 = CM4: as CM4 on sheet GPIO

## Sheet SD Card.SchDoc
size A4
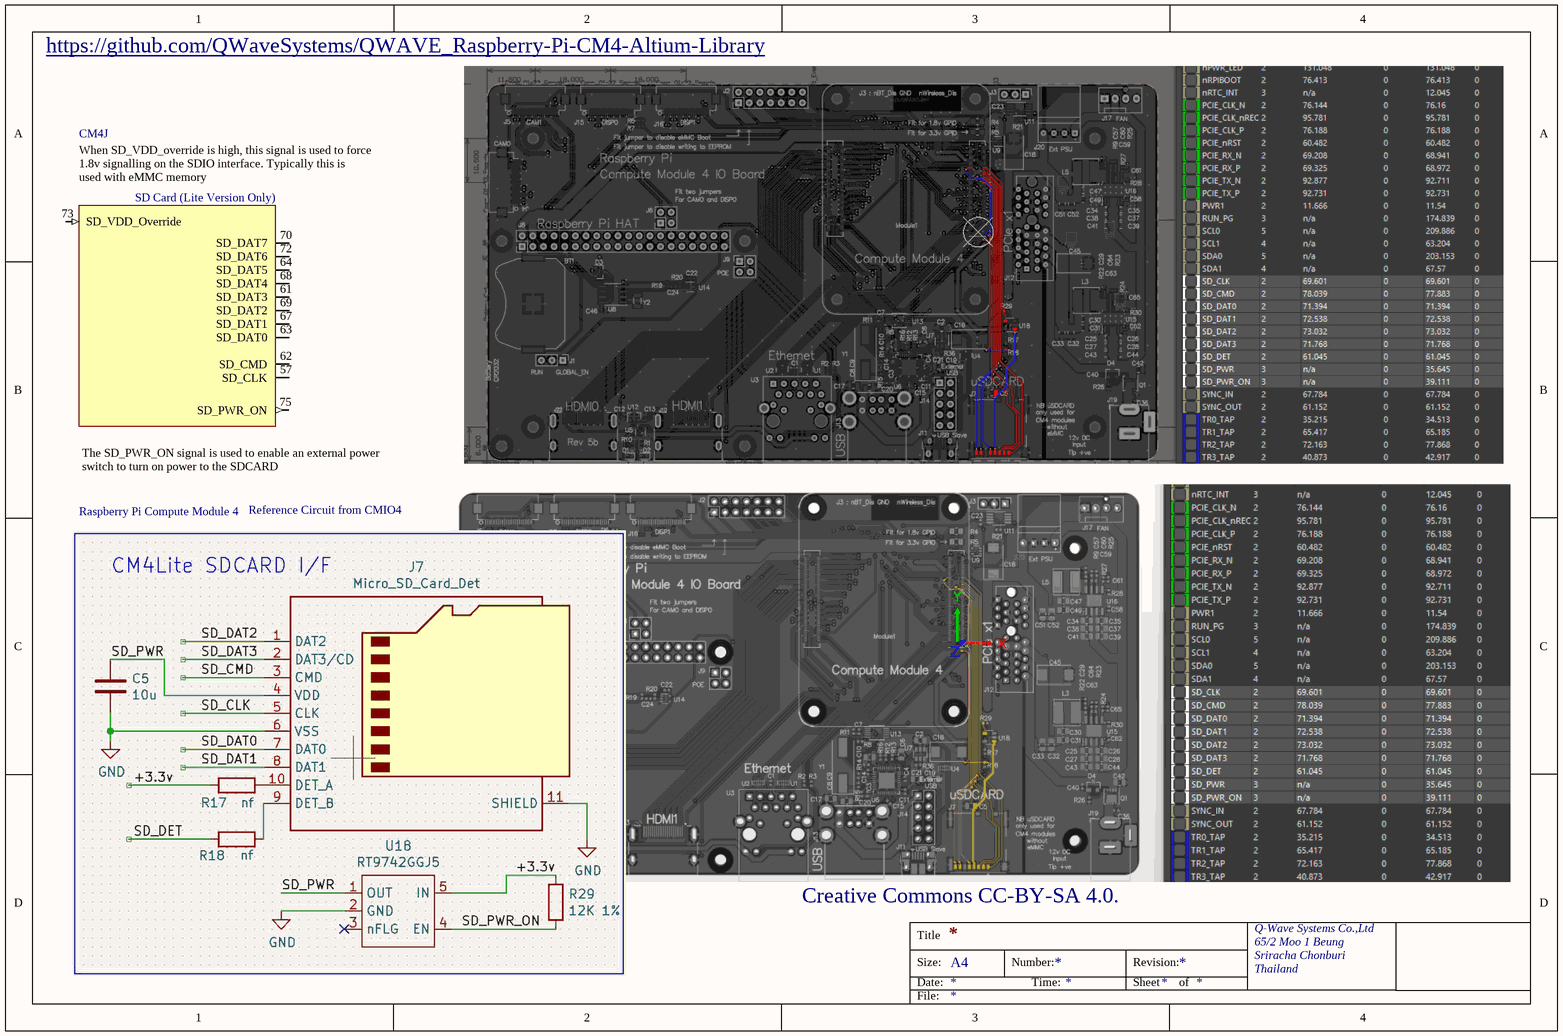
[diagram p13: SD Card.SchDoc]

### Parts
CM4  Raspberry Pi Compute Module 4  [CM4-F40C-100DS-0.4v_1.5mm_0mm]  (part J of 21)  (no BOM)

### Nets

Not connected (* = marked no-connect by the designer): CM4 57(SD_CLK) 61(SD_DAT3) 62(SD_CMD) 63(SD_DAT0) 64(SD_DAT5) 67(SD_DAT1) 68(SD_DAT4) 69(SD_DAT2) 70(SD_DAT7) 72(SD_DAT6) 73(SD_VDD_Override) 75(SD_PWR_ON)

### Notes on the sheet
- https://github.com/QWaveSystems/QWAVE_Raspberry-Pi-CM4-Altium-Library
- Reference Circuit from CMIO4
- Creative Commons CC-BY-SA 4.0.
- Title
- Size:
- Date:
- A4
- Number:
- Time:
- Revision:
- Sheet
- of
- Q-Wave Systems Co.,Ltd
- 65/2 Moo 1 Beung
- Sriracha Chonburi
- Thailand
- File:
- (in symbol CM4, part J) When SD_VDD_override is high, this signal is used to force 1.8v signalling on the SDIO interface. Typically this is / used with eMMC memory; SD Card (Lite Version Only); by Amornthep Phunsin; The SD_PWR_ON signal is used to enable an external power switch to turn on power to the SDCARD

### Library data of the parts
CM4 = CM4: as CM4 on sheet GPIO

## Sheet BT WiFi Power Reset Control.SchDoc
size A4
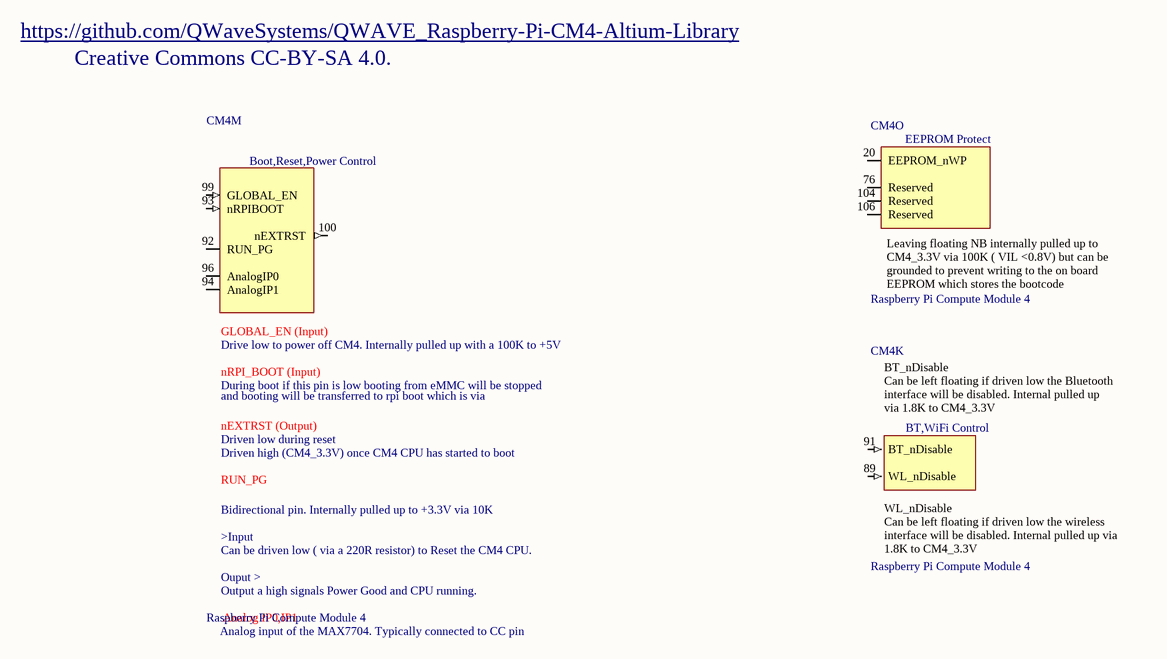
[diagram p14: BT WiFi Power Reset Control.SchDoc]

### Parts
CM4  Raspberry Pi Compute Module 4  [CM4-F40C-100DS-0.4v_1.5mm_0mm]  (parts K,M,O of 21)  (no BOM)

### Nets

Not connected (* = marked no-connect by the designer): CM4 20(EEPROM_nWP) 76(Reserved) 89(WL_nDisable) 91(BT_nDisable) 92(RUN_PG) 93(nRPIBOOT) 94(AnalogIP1) 96(AnalogIP0) 99(GLOBAL_EN) 100(nEXTRST) 104(Reserved) 106(Reserved)

### Notes on the sheet
- https://github.com/QWaveSystems/QWAVE_Raspberry-Pi-CM4-Altium-Library
- Creative Commons CC-BY-SA 4.0.
- Title
- Size:
- Date:
- A4
- Number:
- Time:
- Revision:
- Sheet
- of
- Q-Wave Systems Co.,Ltd
- 65/2 Moo 1 Beung
- Sriracha Chonburi
- Thailand
- File:
- (in symbol CM4, part K) BT_nDisable / Can be left floating if driven low the Bluetooth interface will be disabled. Internal pulled up / via 1.8K to CM4_3.3V; BT,WiFi Control; WL_nDisable / Can be left floating if driven low the wireless interface will be disabled. Internal pulled up via / 1.8K to CM4_3.3V
- (in symbol CM4, part M) Boot,Reset,Power Control; GLOBAL_EN (Input); Drive low to power off CM4. Internally pulled up with a 100K to +5V; nRPI_BOOT (Input); During boot if this pin is low booting from eMMC will be stopped; and booting will be transferred to rpi boot which is via; nEXTRST (Output); Driven low during reset; Driven high (CM4_3.3V) once CM4 CPU has started to boot; Bidirectional pin. Internally pulled up to +3.3V via 10K / >Input / Can be driven low ( via a 220R resistor) to Reset the CM4 CPU. / Ouput > / Output a high signals Power Good and CPU running.; Analog IP0,IP1; Analog input of the MAX7704. Typically connected to CC pin
- (in symbol CM4, part O) EEPROM Protect; Leaving floating NB internally pulled up to CM4_3.3V via 100K ( VIL <0.8V) but can be / grounded to prevent writing to the on board EEPROM which stores the bootcode

### Library data of the parts
CM4 = CM4: as CM4 on sheet GPIO

## Sheet TV DAC.SchDoc
size A4
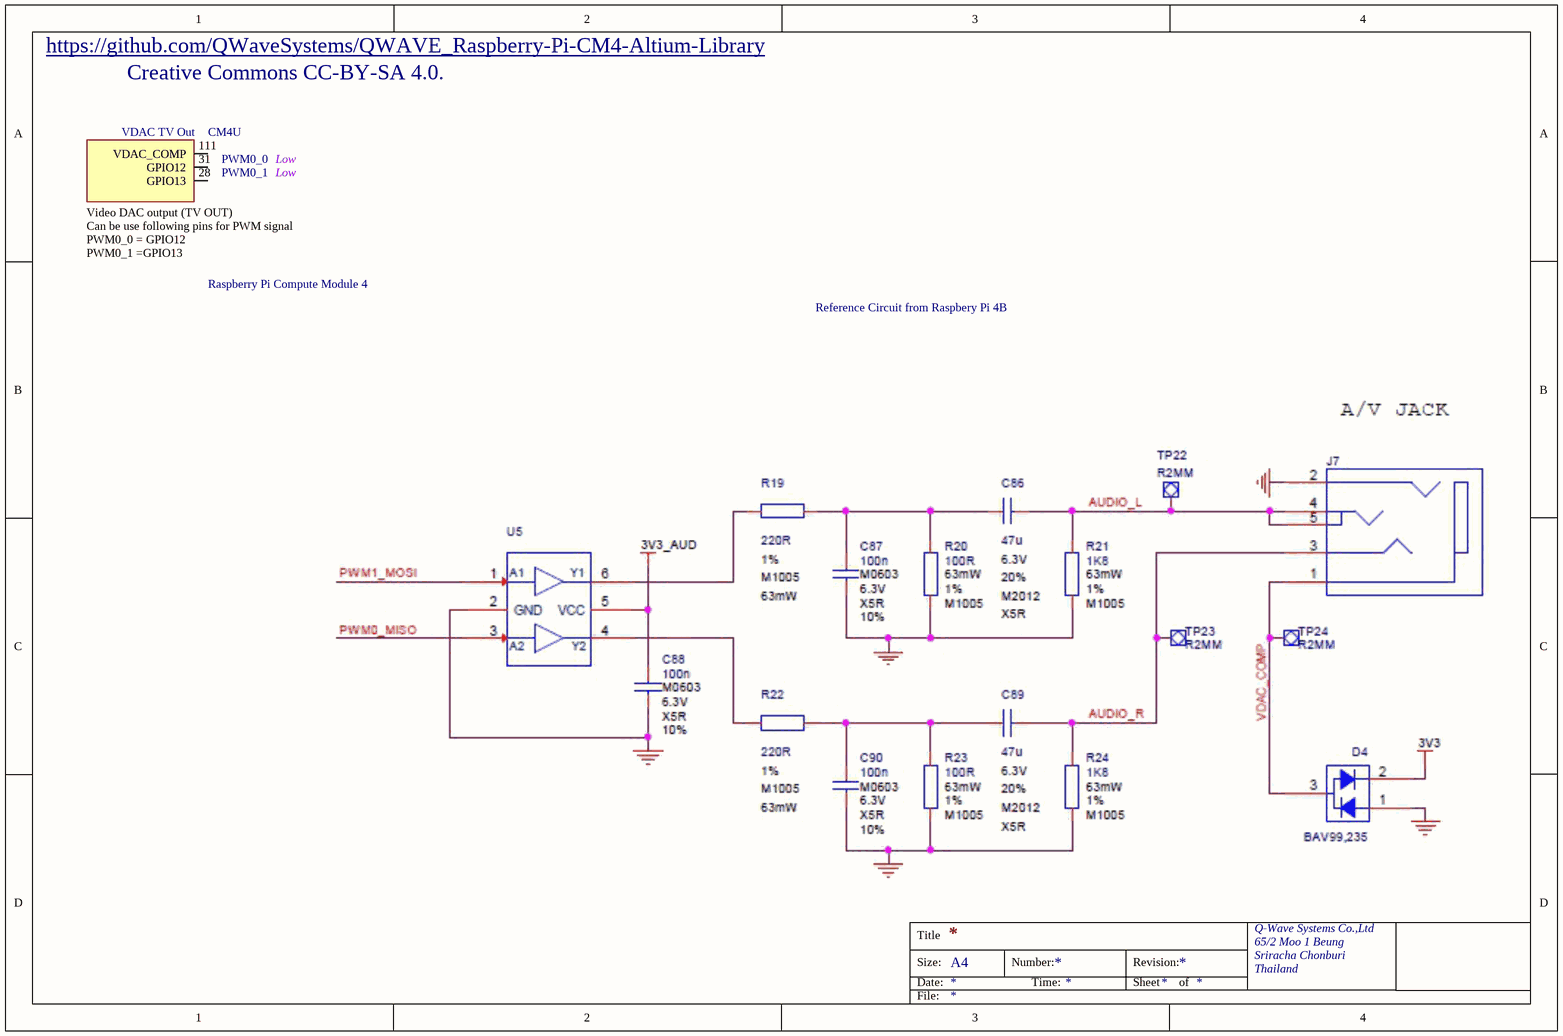
[diagram p15: TV DAC.SchDoc]

### Parts
CM4  Raspberry Pi Compute Module 4  [CM4-F40C-100DS-0.4v_1.5mm_0mm]  (part U of 21)  (no BOM)

### Nets

Not connected (* = marked no-connect by the designer): CM4 28(GPIO13) 31(GPIO12) 111(VDAC_COMP)

### Notes on the sheet
- https://github.com/QWaveSystems/QWAVE_Raspberry-Pi-CM4-Altium-Library
- Creative Commons CC-BY-SA 4.0.
- Reference Circuit from Raspbery Pi 4B
- Title
- Size:
- Date:
- A4
- Number:
- Time:
- Revision:
- Sheet
- of
- Q-Wave Systems Co.,Ltd
- 65/2 Moo 1 Beung
- Sriracha Chonburi
- Thailand
- File:
- (in symbol CM4, part U) VDAC TV Out; PWM0_0; Low; PWM0_1; Video DAC output (TV OUT) / Can be use following pins for PWM signal / PWM0_0 = GPIO12 / PWM0_1 =GPIO13

### Library data of the parts
CM4 = CM4: as CM4 on sheet GPIO

## Sheet LEDs.SchDoc
size A4
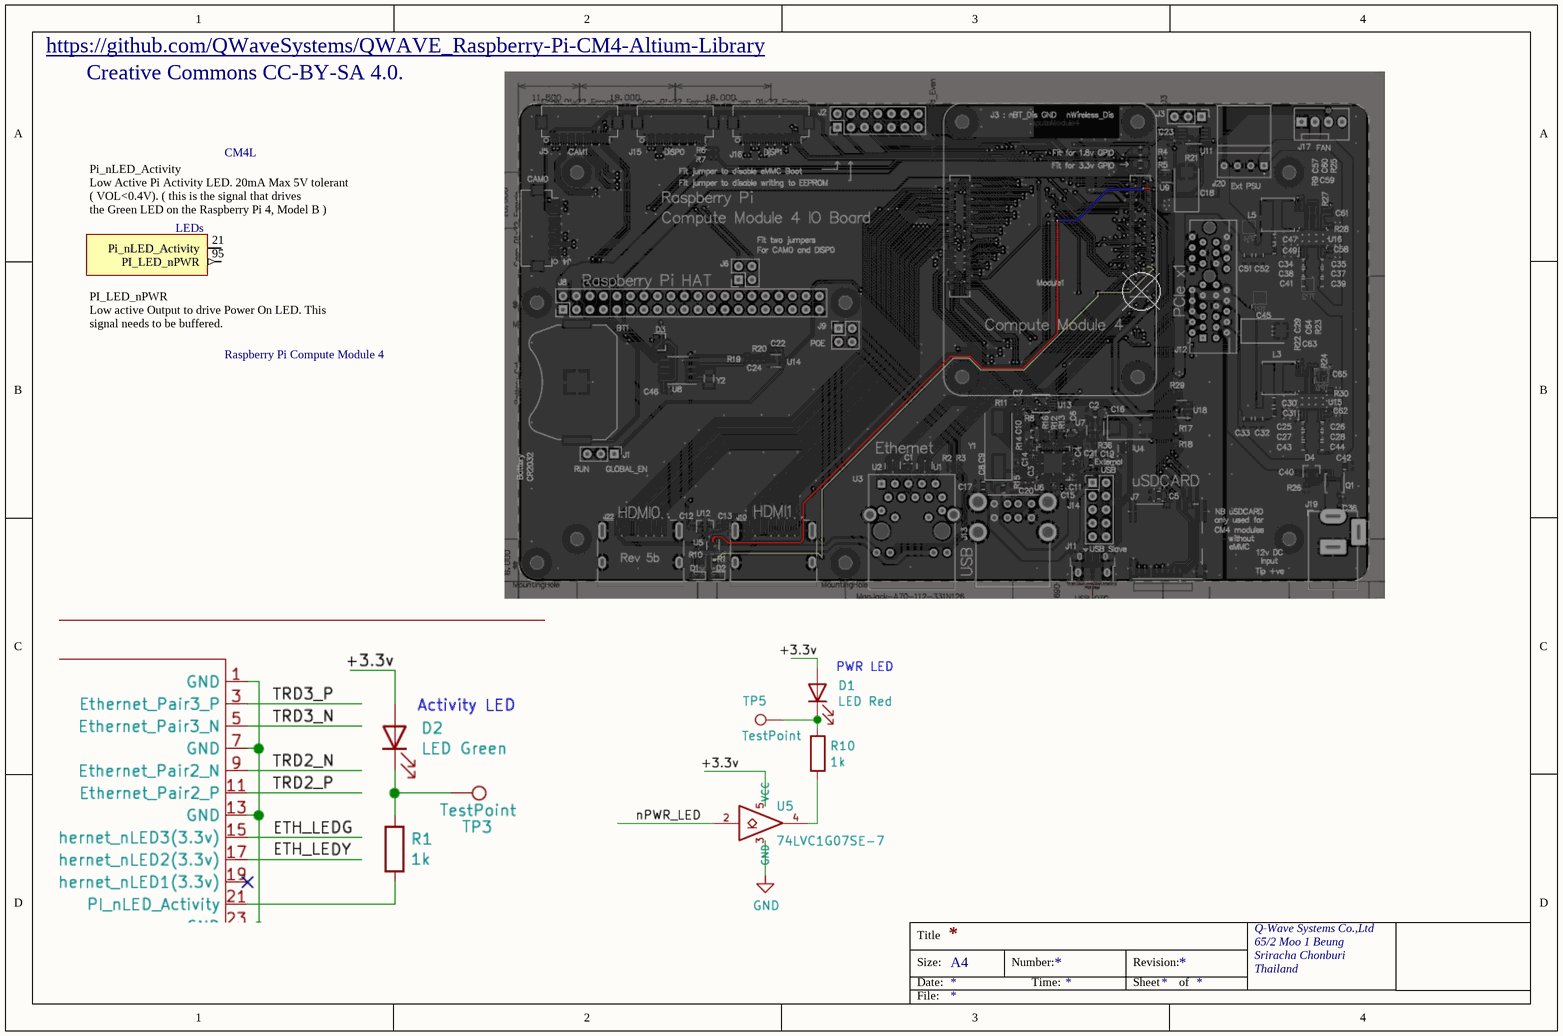
[diagram p16: LEDs.SchDoc]

### Parts
CM4  Raspberry Pi Compute Module 4  [CM4-F40C-100DS-0.4v_1.5mm_0mm]  (part L of 21)  (no BOM)

### Nets

Not connected (* = marked no-connect by the designer): CM4 21(Pi_nLED_Activity) 95(PI_LED_nPWR)

### Notes on the sheet
- https://github.com/QWaveSystems/QWAVE_Raspberry-Pi-CM4-Altium-Library
- Creative Commons CC-BY-SA 4.0.
- Title
- Size:
- Date:
- A4
- Number:
- Time:
- Revision:
- Sheet
- of
- Q-Wave Systems Co.,Ltd
- 65/2 Moo 1 Beung
- Sriracha Chonburi
- Thailand
- File:
- (in symbol CM4, part L) Pi_nLED_Activity / Low Active Pi Activity LED. 20mA Max 5V tolerant ( VOL<0.4V). ( this is the signal that drives / the Green LED on the Raspberry Pi 4, Model B ); LEDs; PI_LED_nPWR / Low active Output to drive Power On LED. This signal needs to be buffered.

### Library data of the parts
CM4 = CM4: as CM4 on sheet GPIO

## Sheet Differential Pair match spec.SchDoc
size A4
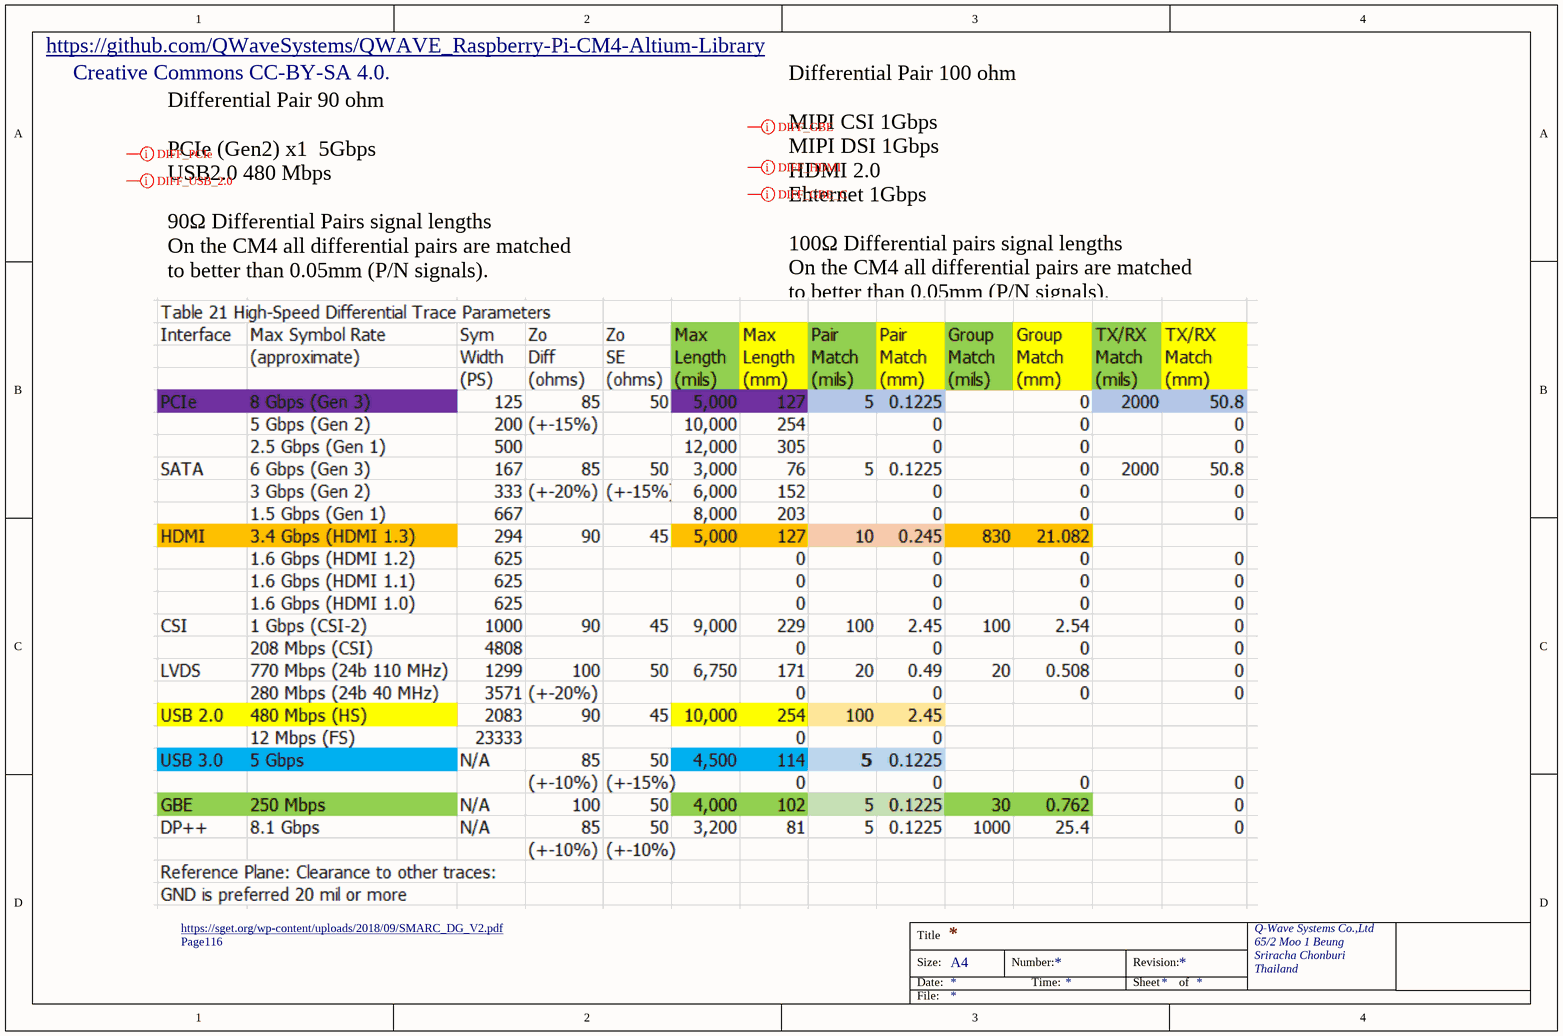
[diagram p17: Differential Pair match spec.SchDoc]

### Layout directives
differential pair; differential pair class DIFF_100Ohm_GBE; differential pair class DIFF_LAN_GB; net class GBE_1Gbps: (no net found under the mark)
differential pair; differential pair class DIFF_100Ohm_MIPI; differential pair class DIFF_MIPI; net class MIPI_1Gbps: (no net found under the mark)
differential pair; differential pair class DIFF_90Ohm_USB2.0; differential pair class DIFF_USB2.0; net class USB2.0_480Mbps: (no net found under the mark)
differential pair; differential pair class DIFF_90Ohm_PCIe; differential pair class DIFF_PCIe; net class PCIe_5Gbps: (no net found under the mark)
differential pair; differential pair class DIFF_100Ohm_HDMI; differential pair class DIFF_HDMI; net class HDMI_18Gbps: (no net found under the mark)

### Notes on the sheet
- https://github.com/QWaveSystems/QWAVE_Raspberry-Pi-CM4-Altium-Library
- Creative Commons CC-BY-SA 4.0.
- Differential Pair 90 ohm
  PCIe (Gen2) x1  5Gbps
  USB2.0 480 Mbps
  90Ω Differential Pairs signal lengths
  On the CM4 all differential pairs are matched to better than 0.05mm (P/N signals).
- Differential Pair 100 ohm
  MIPI CSI 1Gbps
  MIPI DSI 1Gbps
  HDMI 2.0
  Ehternet 1Gbps
  100Ω Differential pairs signal lengths
  On the CM4 all differential pairs are matched to better than 0.05mm (P/N signals).
- https://sget.org/wp-content/uploads/2018/09/SMARC_DG_V2.pdf
- Page116
- Title
- Size:
- Date:
- A4
- Number:
- Time:
- Revision:
- Sheet
- of
- Q-Wave Systems Co.,Ltd
- 65/2 Moo 1 Beung
- Sriracha Chonburi
- Thailand
- File:

## Sheet CMIO4 PCB Stackup.SchDoc
size A4
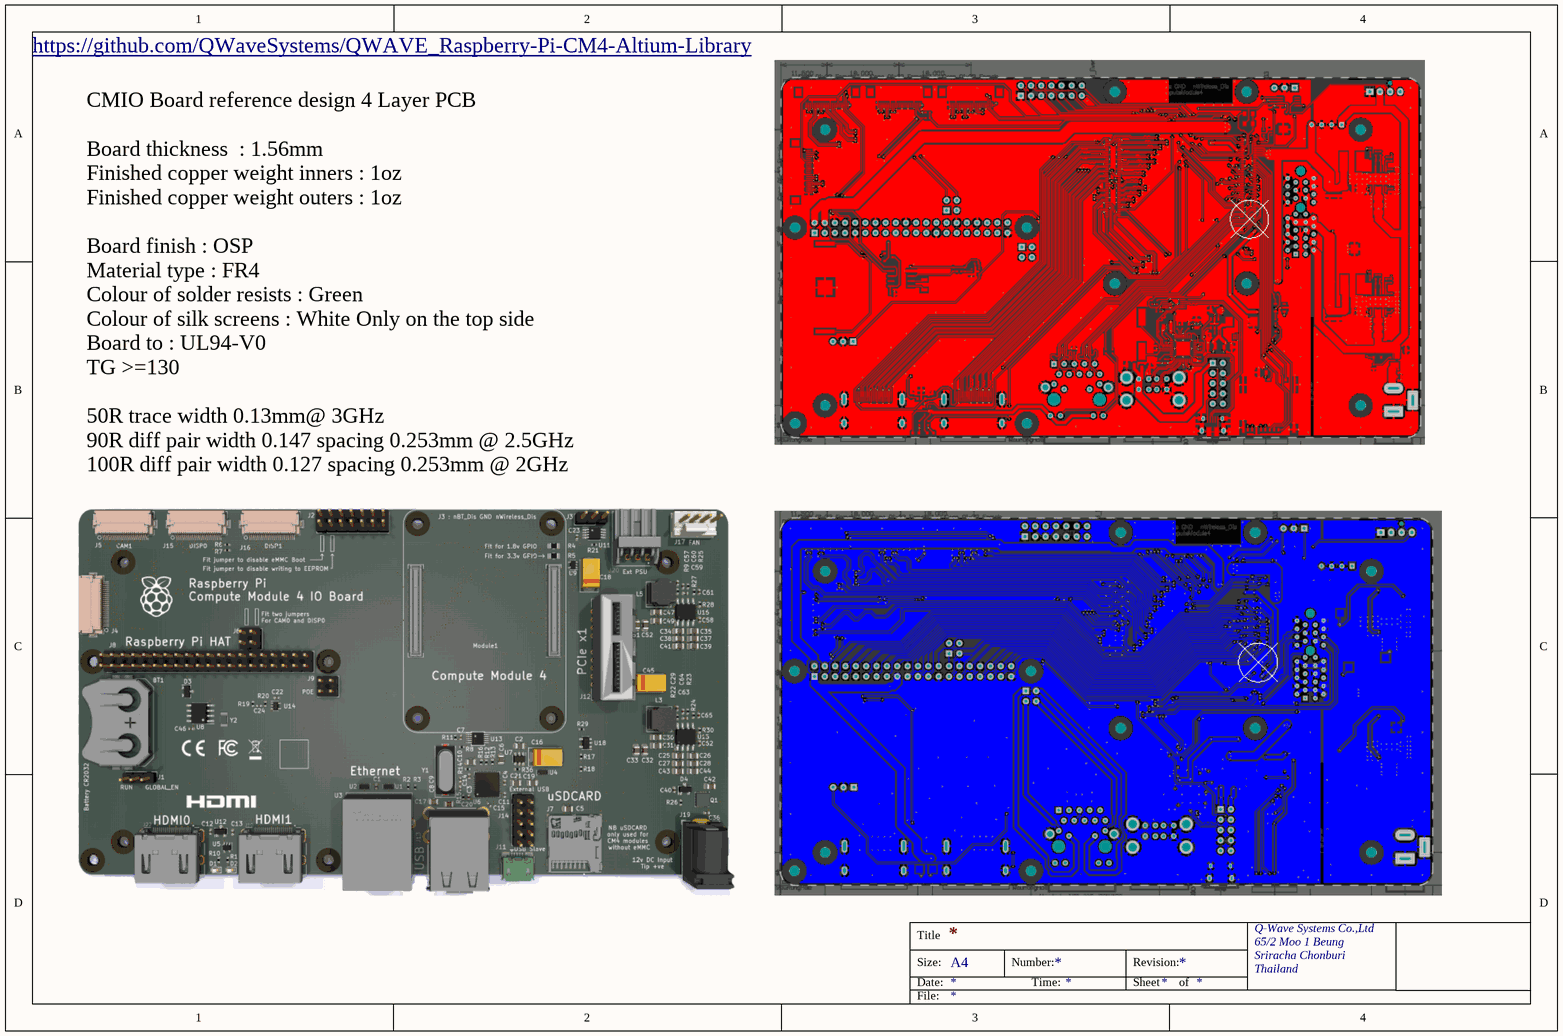
[diagram p18: CMIO4 PCB Stackup.SchDoc]

### Notes on the sheet
- https://github.com/QWaveSystems/QWAVE_Raspberry-Pi-CM4-Altium-Library
- CMIO Board reference design 4 Layer PCB
  Board thickness  : 1.56mm
  Finished copper weight inners : 1oz
  Finished copper weight outers : 1oz
  Board finish : OSP
  Material type : FR4
  Colour of solder resists : Green
  Colour of silk screens : White Only on the top side
  Board to : UL94-V0
  TG >=130
  50R trace width 0.13mm@ 3GHz
  90R diff pair width 0.147 spacing 0.253mm @ 2.5GHz
  100R diff pair width 0.127 spacing 0.253mm @ 2GHz
- Title
- Size:
- Date:
- A4
- Number:
- Time:
- Revision:
- Sheet
- of
- Q-Wave Systems Co.,Ltd
- 65/2 Moo 1 Beung
- Sriracha Chonburi
- Thailand
- File:

## Sheet 3D_Board_View.SchDoc
size A4
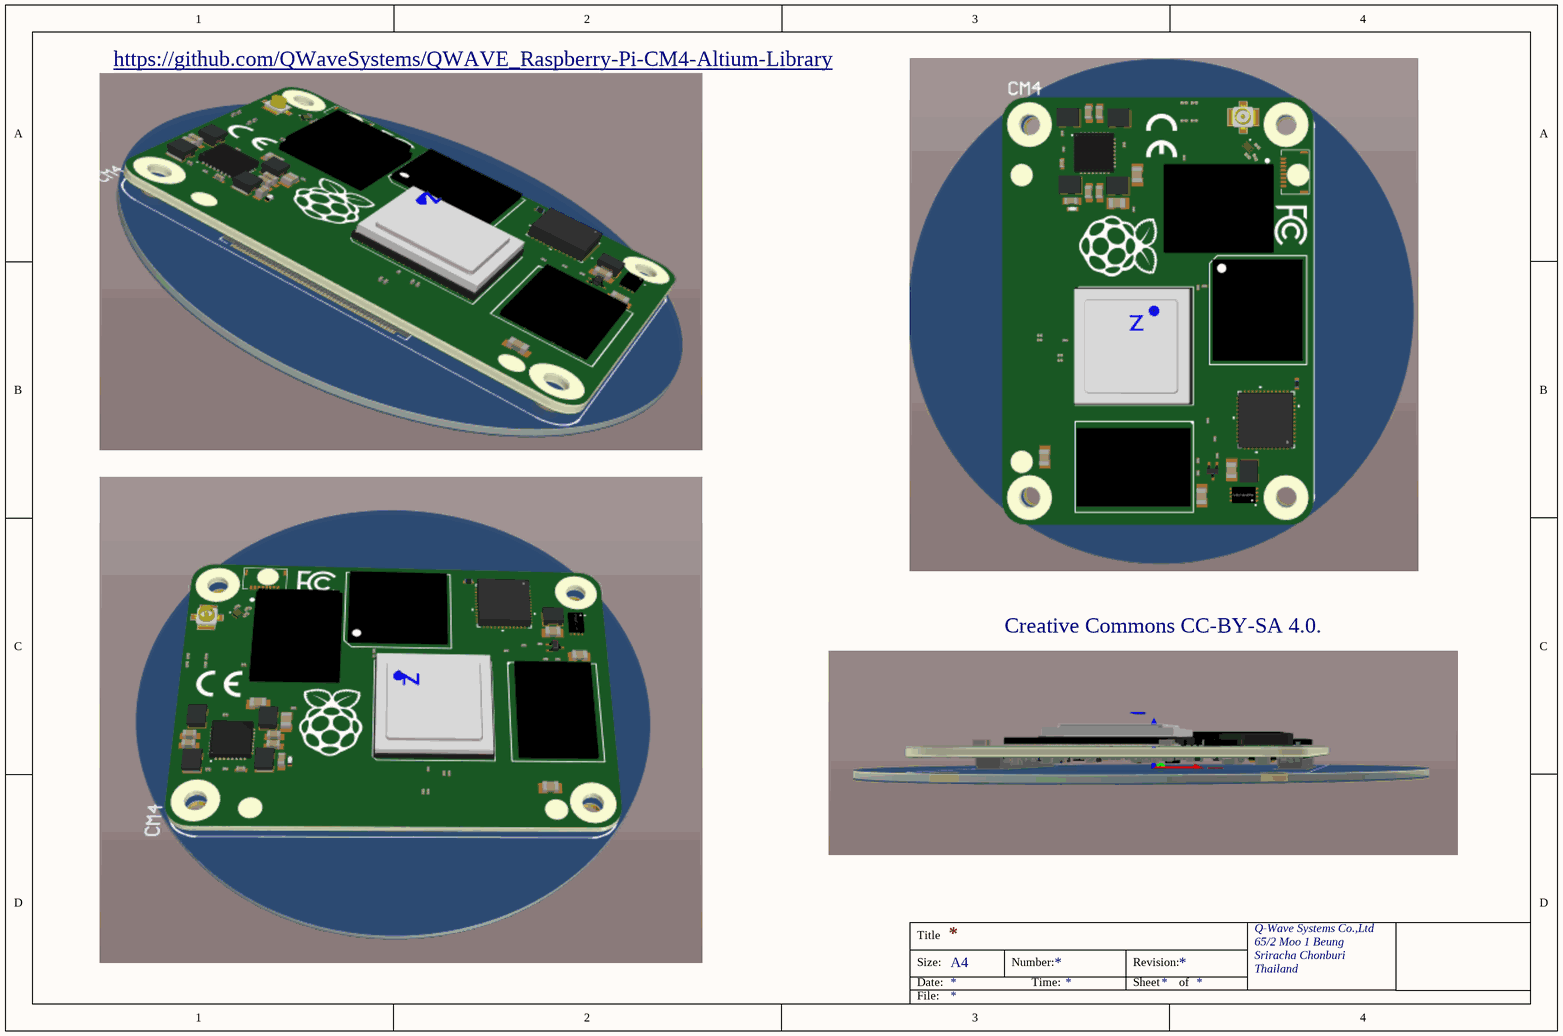
[diagram p19: 3D_Board_View.SchDoc]

### Notes on the sheet
- https://github.com/QWaveSystems/QWAVE_Raspberry-Pi-CM4-Altium-Library
- Creative Commons CC-BY-SA 4.0.
- Title
- Size:
- Date:
- A4
- Number:
- Time:
- Revision:
- Sheet
- of
- Q-Wave Systems Co.,Ltd
- 65/2 Moo 1 Beung
- Sriracha Chonburi
- Thailand
- File:

## Sheet QWAVE-Stackup_Design_6Layer_3GHz.SchDoc
size A4
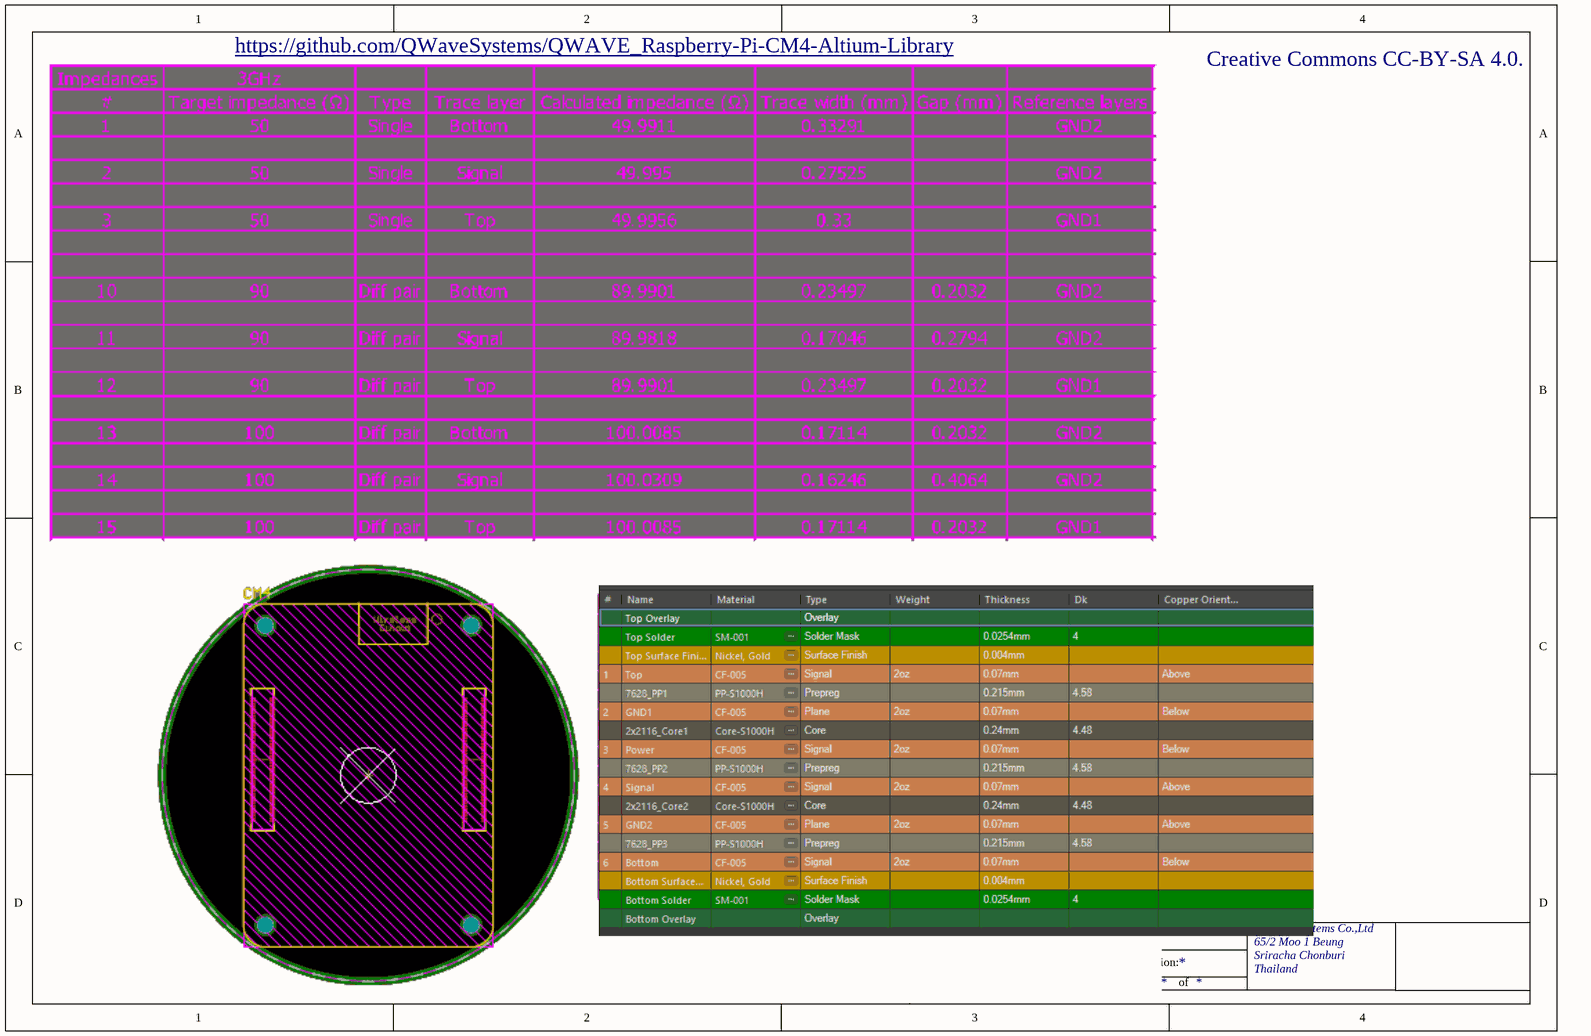
[diagram p20: QWAVE-Stackup_Design_6Layer_3GHz.SchDoc]

### Notes on the sheet
- https://github.com/QWaveSystems/QWAVE_Raspberry-Pi-CM4-Altium-Library
- Creative Commons CC-BY-SA 4.0.
- Title
- Size:
- Date:
- A4
- Number:
- Time:
- Revision:
- Sheet
- of
- Q-Wave Systems Co.,Ltd
- 65/2 Moo 1 Beung
- Sriracha Chonburi
- Thailand
- File:

## Sheet PCB_Footprint.SchDoc
size A
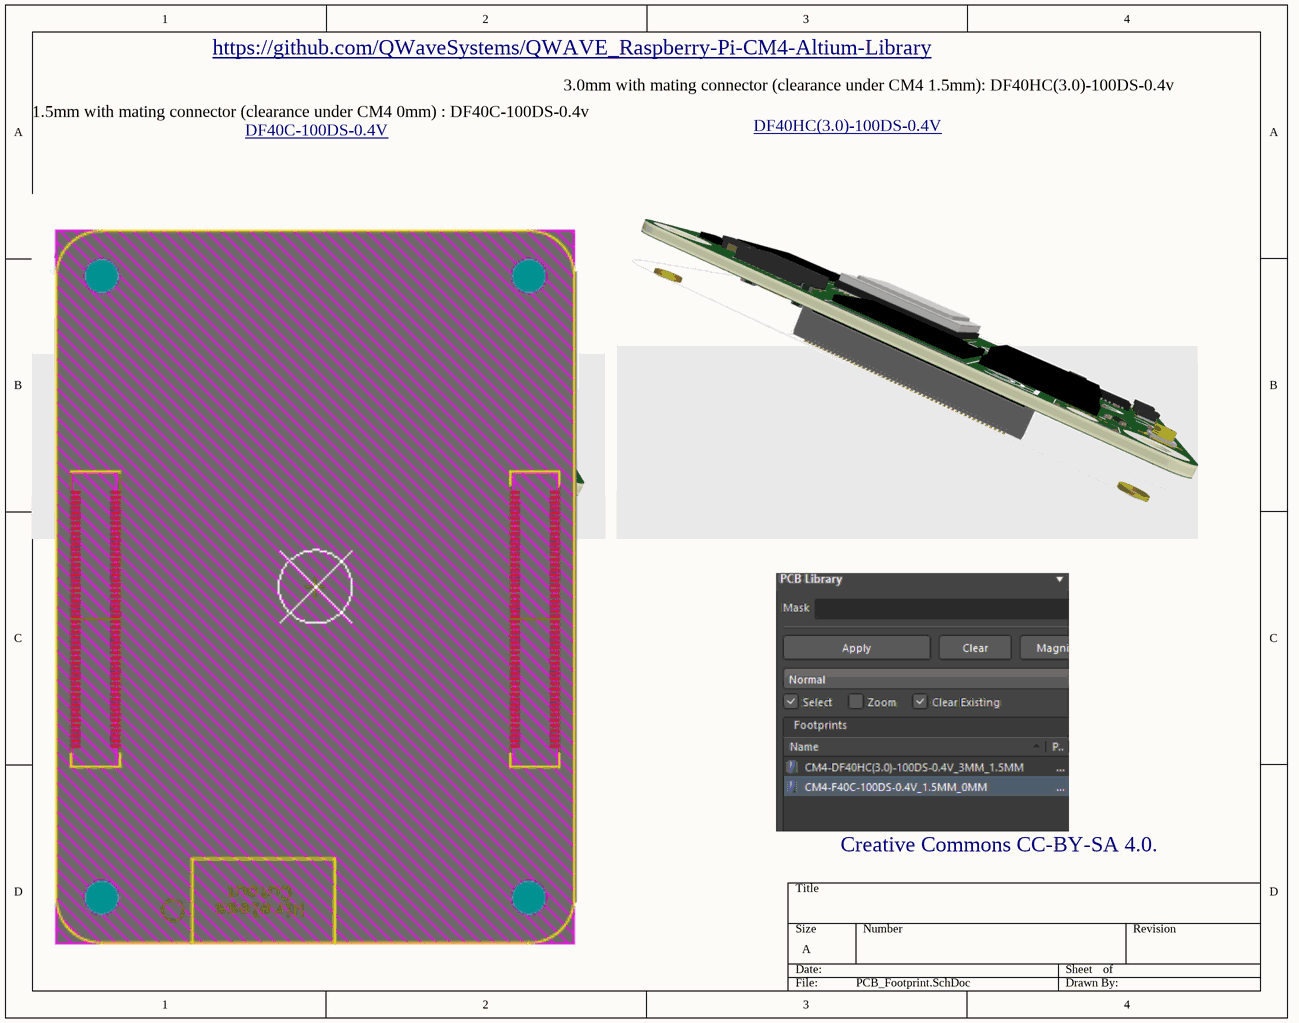
[diagram p21: PCB_Footprint.SchDoc]

### Notes on the sheet
- https://github.com/QWaveSystems/QWAVE_Raspberry-Pi-CM4-Altium-Library
- 1.5mm with mating connector (clearance under CM4 0mm) : DF40C-100DS-0.4v
- DF40C-100DS-0.4V <https://www.hirose.com/product/p/CL0684-4033-4-51>
- 3.0mm with mating connector (clearance under CM4 1.5mm): DF40HC(3.0)-100DS-0.4v
- DF40HC(3.0)-100DS-0.4V <https://www.hirose.com/product/p/CL0684-4151-0-51>
- Creative Commons CC-BY-SA 4.0.